# Altium project Relay-Driver-Board-v1.0.PrjPcb (part 5 of 5)
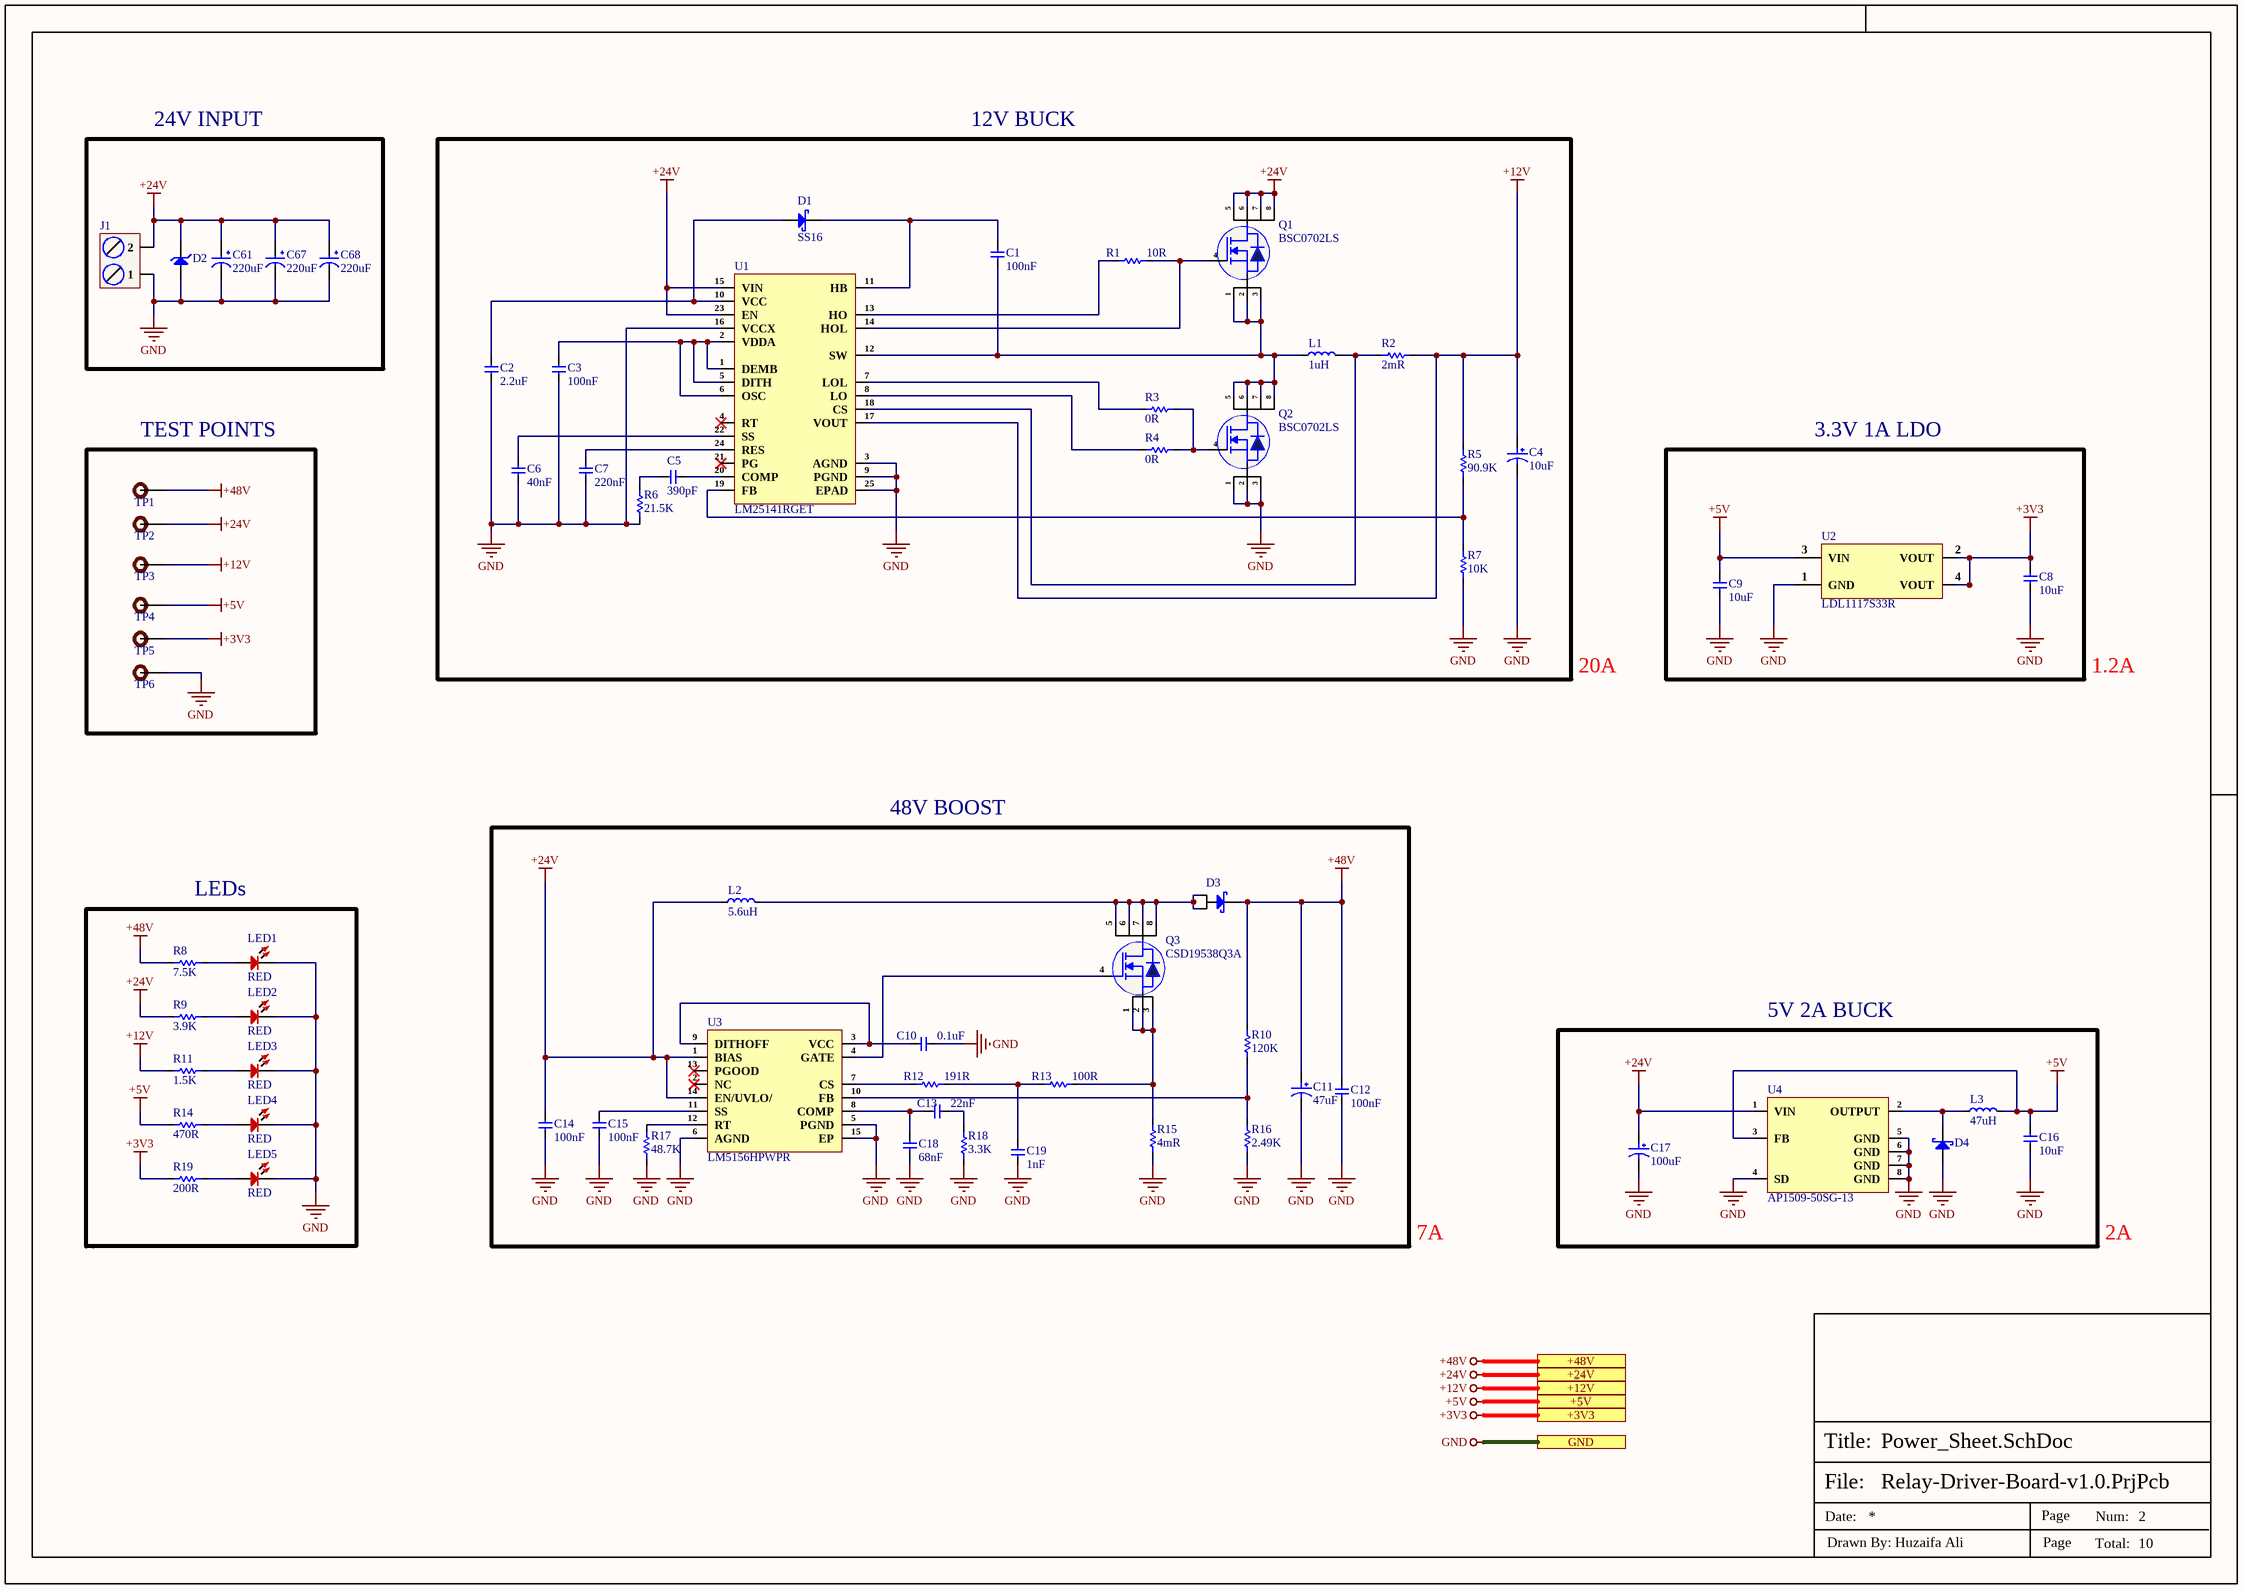
[diagram p11: Power_Sheet.SchDoc]

## Sheet Power_Sheet.SchDoc (continued)

### Library data of the parts (continued)
R19 = RC0402FR-07200RL: RES 200 OHM 1% 1/16W 0402; Manufacturer: Yageo; Temperature Coefficient: 100ppm/°C; Power Rating: 63mW; Voltage Rating (DC): 50V; Supplier 1: Digi-Key; Manufacturer Part Number: RC0402FR-07200RL; RoHS: Yes; Category: Chip SMD Resistors; Stock 1: 19778; Pricing 1: 1=0.10000, 10=0.01600, 100=0.00660, 1000=0.00299, 2500=0.00259, 5000=0.00214 (USD); Case/Package: 0402; Case Code (Metric): 1005; Case Code (Imperial): 0402; Size Code: 0402; Min Operating Temperature: -55°C; Max Operating Temperature: 155°C; Tolerance: 1%; Resistance: 200R; Resistor Type: Thick Film; Packaging: Tape and Reel; Voltage Rating: 50V; Package Quantity: 1; Number of Terminations: 2; Termination: SMD/SMT; Max Power Dissipation: 63mW; Features: Moisture Resistant; Series: RC; Construction: Rectangular; Resistance Tolerance: 1%; Length: 1mm; Width: 0.02inch; Height: 0.016inch; Depth: 0.5mm; REACH SVHC: No SVHC; Lead Free: Lead Free; RoHS Compliant: Yes; Military Standard: Not; ComponentLink1URL: https://datasheet.ciiva.com/2553/pyu-r-int-thick-7-2553232.pdf?src-supplier=Digi-Key; ComponentLink1Description: https://datasheet.ciiva.com/2553/pyu-r-int-thick-7-2553232.pdf?src-supplier=Digi-Key; ComponentLink2URL: https://datasheet.ciiva.com/7983/1018594-7983509.pdf?src-supplier=Element14; ComponentLink2Description: https://datasheet.ciiva.com/7983/1018594-7983509.pdf?src-supplier=Element14; ComponentLink3URL: https://datasheet.ciiva.com/16804/pyu-rc0402-51-rohs-l-6-r-16804406.pdf?src-supplier=Future+Electronics; ComponentLink3Description: https://datasheet.ciiva.com/16804/pyu-rc0402-51-rohs-l-6-r-16804406.pdf?src-supplier=Future+Electronics; ComponentLink4URL: https://datasheet.ciiva.com/15189/getdatasheetpartid-331152-15189383.pdf?src-supplier=Verical; ComponentLink4Description: https://datasheet.ciiva.com/15189/getdatasheetpartid-331152-15189383.pdf?src-supplier=Verical; ComponentLink5URL: https://datasheet.ciiva.com/7849/1018594-7849898.pdf?src-supplier=Element14; ComponentLink5Description: https://datasheet.ciiva.com/7849/1018594-7849898.pdf?src-supplier=Element14; ComponentLink6URL: https://datasheet.ciiva.com/5562/pyu-rc0402-51-rohs-l-6-r-8721-5562539.pdf?src-supplier=Mouser; ComponentLink6Description: https://datasheet.ciiva.com/5562/pyu-rc0402-51-rohs-l-6-r-8721-5562539.pdf?src-supplier=Mouser; ComponentLink7URL: https://datasheet.ciiva.com/7849/1018594-7849899.pdf?src-supplier=Element14; ComponentLink7Description: https://datasheet.ciiva.com/7849/1018594-7849899.pdf?src-supplier=Element14; ComponentLink8URL: https://datasheet.ciiva.com/2553/pyu-r-int-thick-7-2553230.pdf?src-supplier=Digi-Key; ComponentLink8Description: https://datasheet.ciiva.com/2553/pyu-r-int-thick-7-2553230.pdf?src-supplier=Digi-Key; ComponentLink9URL: https://datasheet.ciiva.com/2553/pyu-r-int-thick-7-2553231.pdf?src-supplier=Digi-Key; ComponentLink9Description: https://datasheet.ciiva.com/2553/pyu-r-int-thick-7-2553231.pdf?src-supplier=Digi-Key; Supplier Part Number 1: 311-200LRCT-ND; LCSC Part Number: C114764
TP1-TP6 = TEST POINT: Test Point ON; Item Type: TEST POINT
U1 = LM25141RGET: LOW VOLTAGE LM5141- SYNC BUCK CO; Manufacturer: Texas Instruments; Item Type: IC; Supplier: Digikey; LCSC Part Number: C2658130; Manufacturer Part Number: LM25141RGET; RoHS: Yes; Stock: 976; Pricing: 1=6.33, 10=5.685, 25=5.3744, 100=4.6579 (USD); ComponentLink1URL: http://www.ti.com/lit/ds/symlink/lm25141.pdf?src-supplier=Farnell; ComponentLink1Description: http://www.ti.com/lit/ds/symlink/lm25141.pdf?src-supplier=Farnell; ComponentLink2URL: http://www.ti.com/general/docs/suppproductinfo.tsp?distId=10&gotoUrl=http%3A%2F%2Fwww.ti.com%2Flit%2Fgpn%2Flm25141&src-supplier=Digikey; ComponentLink2Description: http://www.ti.com/general/docs/suppproductinfo.tsp?distId=10&gotoUrl=http%3A%2F%2Fwww.ti.com%2Flit%2Fgpn%2Flm25141&src-supplier=Digikey
U2 = LDL1117S33R: IC REG LINEAR 3.3V 1.2A SOT223; Manufacturer: STMicroelectronics; Output Type: Fixed; Output Configuration: Positive; Number of Regulators: 1; Max Input Voltage: 18V; Dropout Voltage: 600mV; Quiescent Current: 500uA; Power Supply Rejection Ratio (PSRR): 65dB; Supplier 1: Digi-Key; Manufacturer Part Number: LDL1117S33R; Stock 1: 13064; Pricing 1: 1=0.45, 10=0.362, 100=0.2465, 500=0.1849, 1000=0.13867 (USD); Mount: Surface Mount; Case/Package: TO-261-4; Min Operating Temperature: -40°C; Max Operating Temperature: 125°C; Packaging: Tape and Reel; Min Output Voltage: 3.3V; Output Current: 1.2A; Supplier Part Number 1: 497-17239-6-ND; ComponentLink1Description: LCSC; ComponentLink1URL: https://www.lcsc.com/product-detail/Linear-Voltage-Regulators-LDO_STMicroelectronics-LDL1117S33R_C435835.html; LCSC Part Number: C435835; Item Type: IC
U3 = LM5156HPWPR: 2.2MHZ WIDE INPUT NONSYNCHRONOUS; Manufacturer: Texas Instruments; Item Type: IC; Supplier: Digikey; LCSC Part Number: C2867852; Manufacturer Part Number: LM5156HPWPR; RoHS: No; Stock: 2799; Pricing: 1=2.18, 10=1.954, 25=1.8432, 100=1.5704, 250=1.4746, 500=1.29028, 1000=1.06908 (USD)
U4 = AP1509-50SG-13: IC REG BUCK 5V 2A 8SOP; Manufacturer: Diodes; Number of Outputs: 1; Min Input Voltage: 4.5V; Max Supply Voltage: 22V; Efficiency: 83%; Switching Frequency: 150kHz; Synchronous Rectifier: No; Operating Supply Current: 5mA; Output Type: Fixed; Output Configuration: Positive; Frequency: 173kHz; Supplier 1: Rs; Manufacturer Part Number: AP1509-50SG-13; RoHS: Yes; Category: Voltage Regulators - Switching; Stock 1: 2230; Pricing 1: 25=1.20600, 125=0.91800, 625=0.81800, 1250=0.63800 (GBP); Mounting Technology: Surface Mount; Case/Package: SOP; Pins: 8; Weight: 0.030018oz; Contact Plating: Tin,Matte; Min Operating Temperature: -20°C; Max Operating Temperature: 85°C; Packaging: Tape and Reel; Output Voltage: 5V; Max Output current: 2A; Package Quantity: 2500; Output Current: 2A; Min Supply Voltage: 4.5V; Nominal Output Voltage: 5V; Min Output Voltage: 5V; Max Output Voltage: 5V; Operating Supply Voltage: 22V; Series: -; Length: 4.95mm; Width: 3.95mm; Height: 1.5mm; Reach SVHC Compliant: Yes; Lead Free: Lead Free; RoHS Compliant: Yes; ComponentLink1URL: https://datasheet.ciiva.com/1161/608784-1161660.pdf?src-supplier=Element14; ComponentLink1Description: https://datasheet.ciiva.com/1161/608784-1161660.pdf?src-supplier=Element14; Supplier Part Number 1: 7512923P; LCSC Part Number: C9984; Item Type: IC

## Sheet Relay_PWR_Sheet.SchDoc
size 420 x 297 mm; SheetNumber: 8; SheetTotal: 9
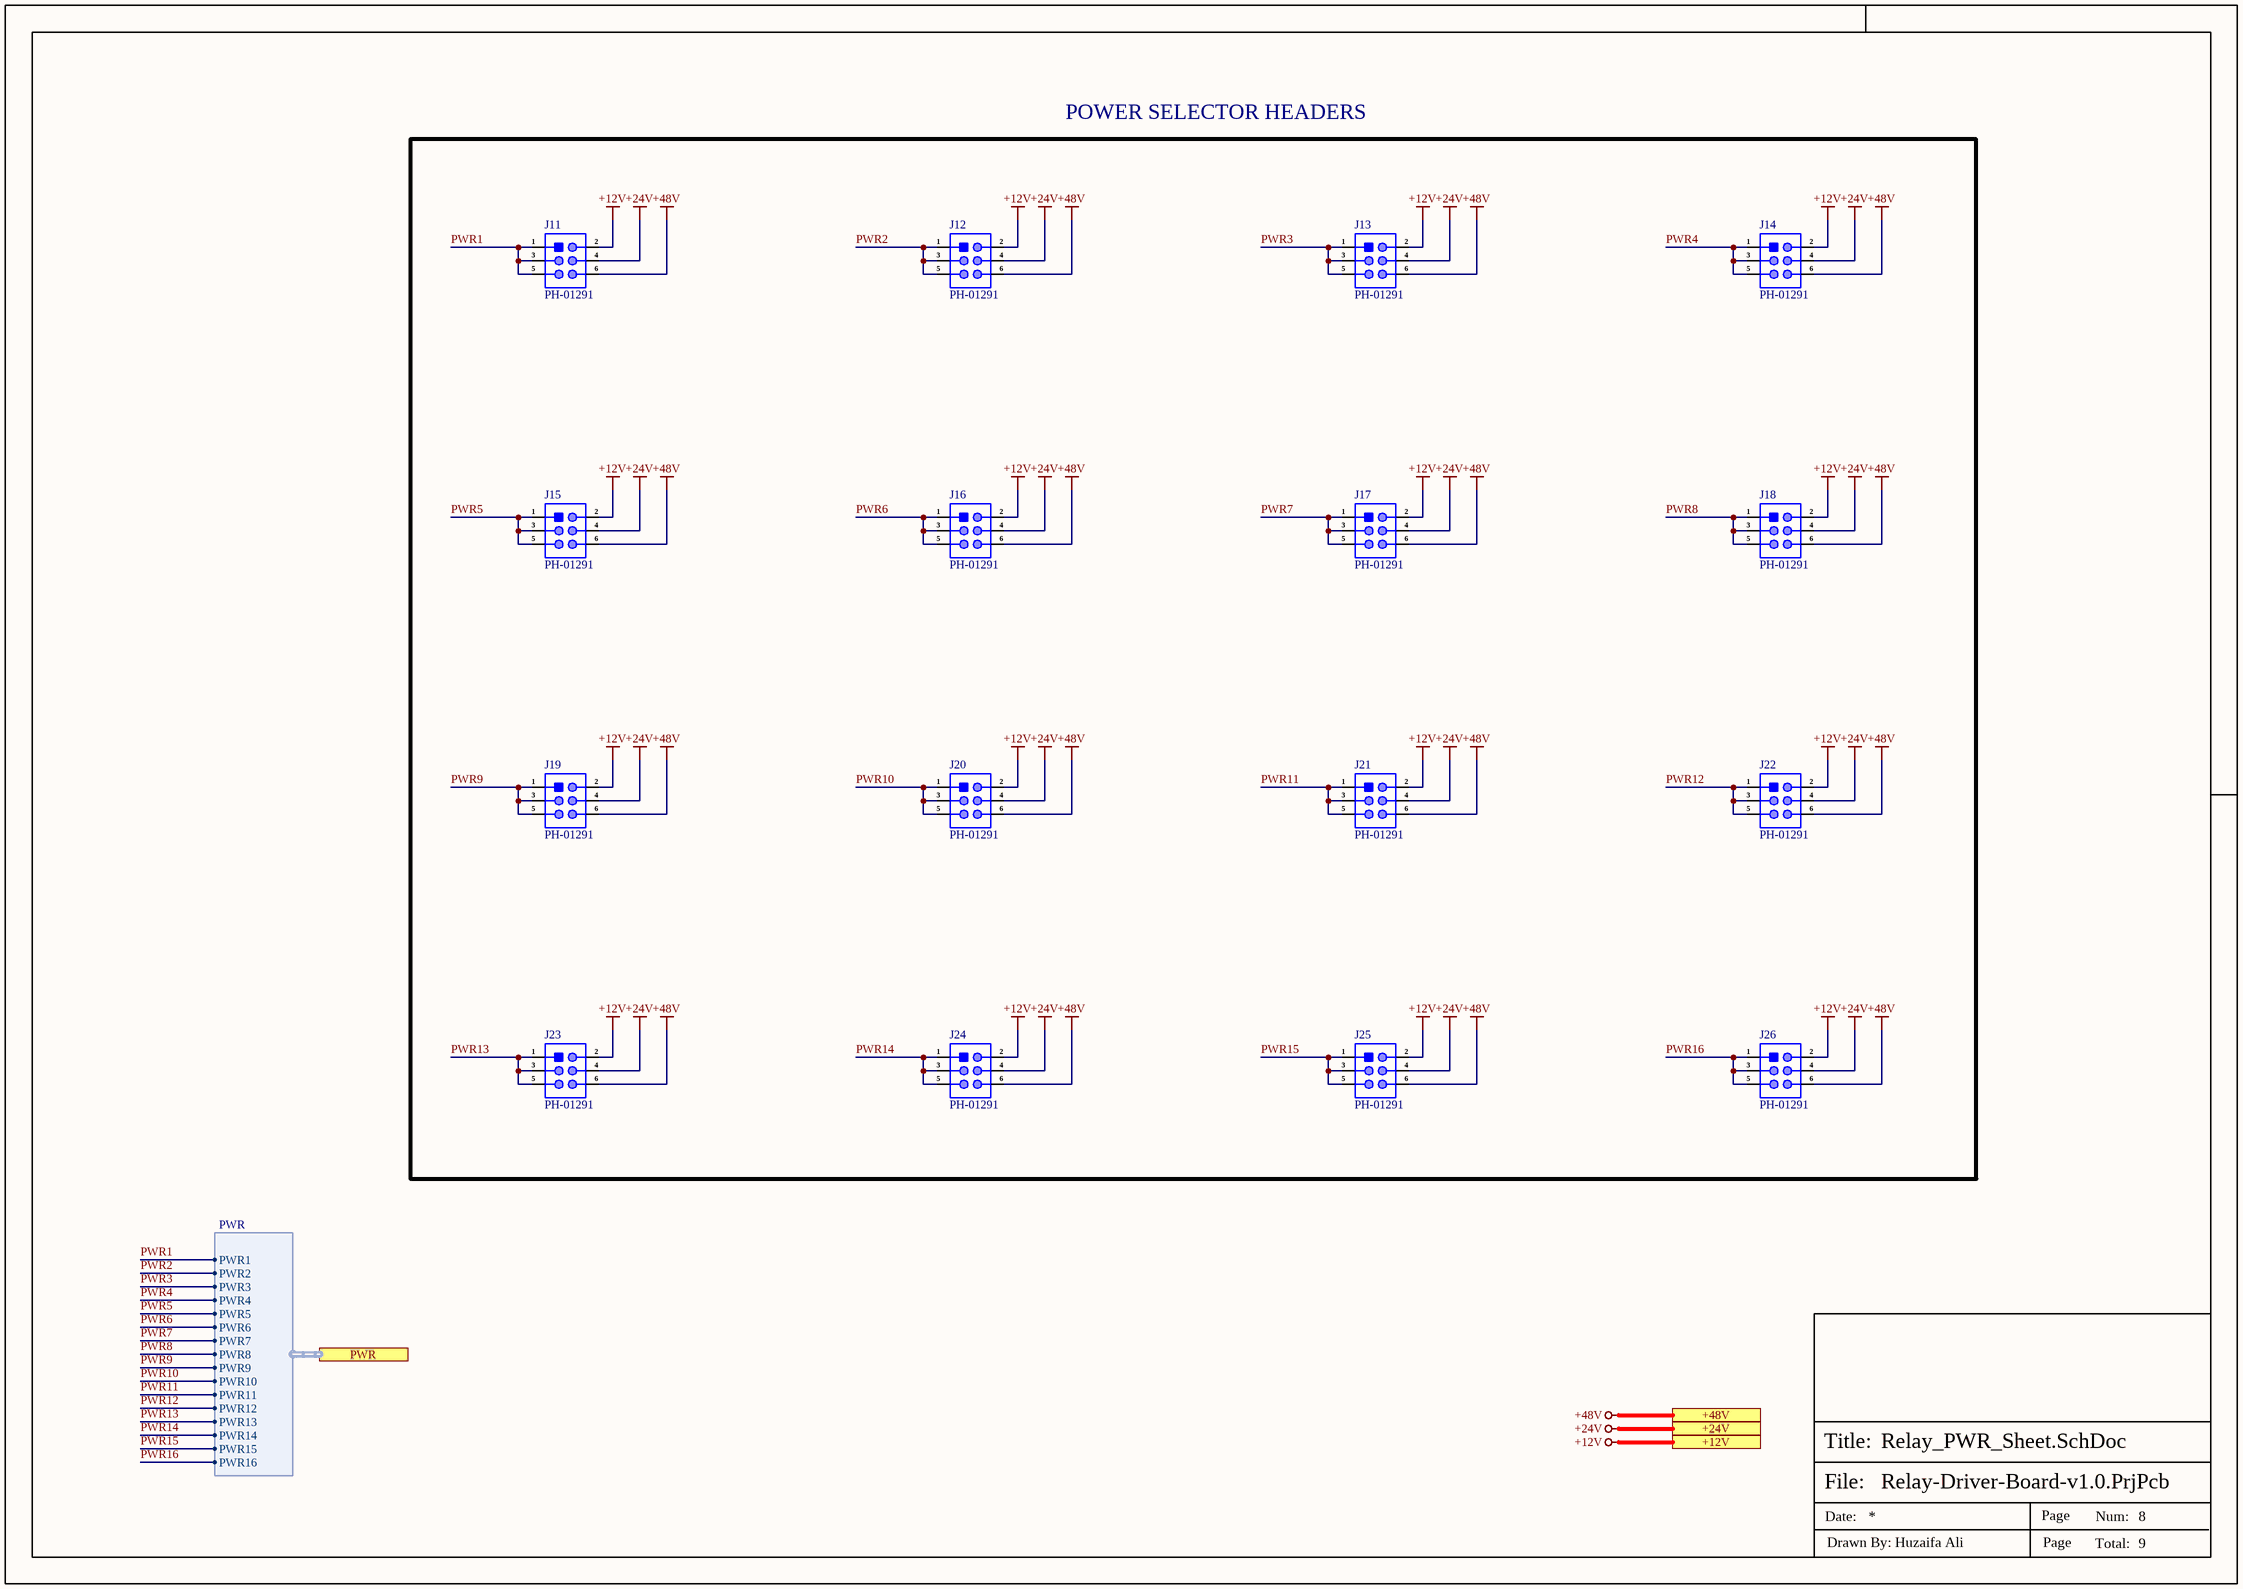
[diagram p6: Relay_PWR_Sheet.SchDoc]

### Parts
J11  PH-01291  [PH-01291]
J12  PH-01291  [PH-01291]
J13  PH-01291  [PH-01291]
J14  PH-01291  [PH-01291]
J15  PH-01291  [PH-01291]
J16  PH-01291  [PH-01291]
J17  PH-01291  [PH-01291]
J18  PH-01291  [PH-01291]
J19  PH-01291  [PH-01291]
J20  PH-01291  [PH-01291]
J21  PH-01291  [PH-01291]
J22  PH-01291  [PH-01291]
J23  PH-01291  [PH-01291]
J24  PH-01291  [PH-01291]
J25  PH-01291  [PH-01291]
J26  PH-01291  [PH-01291]

### Blocks framed on the sheet
POWER SELECTOR HEADERS: J11-J26

### Ports
+12V (see Power_Sheet[5D]), +24V (see Connector_Sheet[5D], Power_Sheet[5D]), +48V (see Power_Sheet[5D]), PWR (harness PWR, see Relay_Sheet[4D])

### Harnesses
PWR: PWR1, PWR2, PWR3, PWR4, PWR5, PWR6, PWR7, PWR8, PWR9, PWR10, PWR11, PWR12, PWR13, PWR14, PWR15, PWR16

### Nets
+12V: J11.2 J12.2 J13.2 J14.2 J15.2 J16.2 J17.2 J18.2 J19.2 J20.2 J21.2 J22.2 J23.2 J24.2 J25.2 J26.2 ; port +12V
+24V: J11.4 J12.4 J13.4 J14.4 J15.4 J16.4 J17.4 J18.4 J19.4 J20.4 J21.4 J22.4 J23.4 J24.4 J25.4 J26.4 ; port +24V
+48V: J11.6 J12.6 J13.6 J14.6 J15.6 J16.6 J17.6 J18.6 J19.6 J20.6 J21.6 J22.6 J23.6 J24.6 J25.6 J26.6 ; port +48V
PWR1: J11.1 J11.3 J11.5 ; port PWR.PWR1
PWR2: J12.1 J12.3 J12.5 ; port PWR.PWR2
PWR3: J13.1 J13.3 J13.5 ; port PWR.PWR3
PWR4: J14.1 J14.3 J14.5 ; port PWR.PWR4
PWR5: J15.1 J15.3 J15.5 ; port PWR.PWR5
PWR6: J16.1 J16.3 J16.5 ; port PWR.PWR6
PWR7: J17.1 J17.3 J17.5 ; port PWR.PWR7
PWR8: J18.1 J18.3 J18.5 ; port PWR.PWR8
PWR9: J19.1 J19.3 J19.5 ; port PWR.PWR9
PWR10: J20.1 J20.3 J20.5 ; port PWR.PWR10
PWR11: J21.1 J21.3 J21.5 ; port PWR.PWR11
PWR12: J22.1 J22.3 J22.5 ; port PWR.PWR12
PWR13: J23.1 J23.3 J23.5 ; port PWR.PWR13
PWR14: J24.1 J24.3 J24.5 ; port PWR.PWR14
PWR15: J25.1 J25.3 J25.5 ; port PWR.PWR15
PWR16: J26.1 J26.3 J26.5 ; port PWR.PWR16

### Notes on the sheet
- File:
- Title:
- Date:
- Page
- Num:
- Total:
- Drawn By: Huzaifa Ali

### Library data of the parts
J11-J26 = PH-01291: 3A Straight Square Pins 2.5mm 6P 6mm -40℃~+105℃ 3mm 2.54mm 双排 Black 2x3P 2.54mm Plugin,P=2.54mm Pin Headers ROHS; Manufacturer: Liansheng; Item Type: Male Header; Manufacturer Part Number: PH-01291; LCSC Part No: C2685197; ComponentLink1URL: https://www.lcsc.com/product-detail/Pin-Headers_Liansheng-PH-01291_C2685197.html; ComponentLink1Description: LCSC

## Sheet Relay_Sheet.SchDoc
size 420 x 297 mm; SheetNumber: 8; SheetTotal: 10
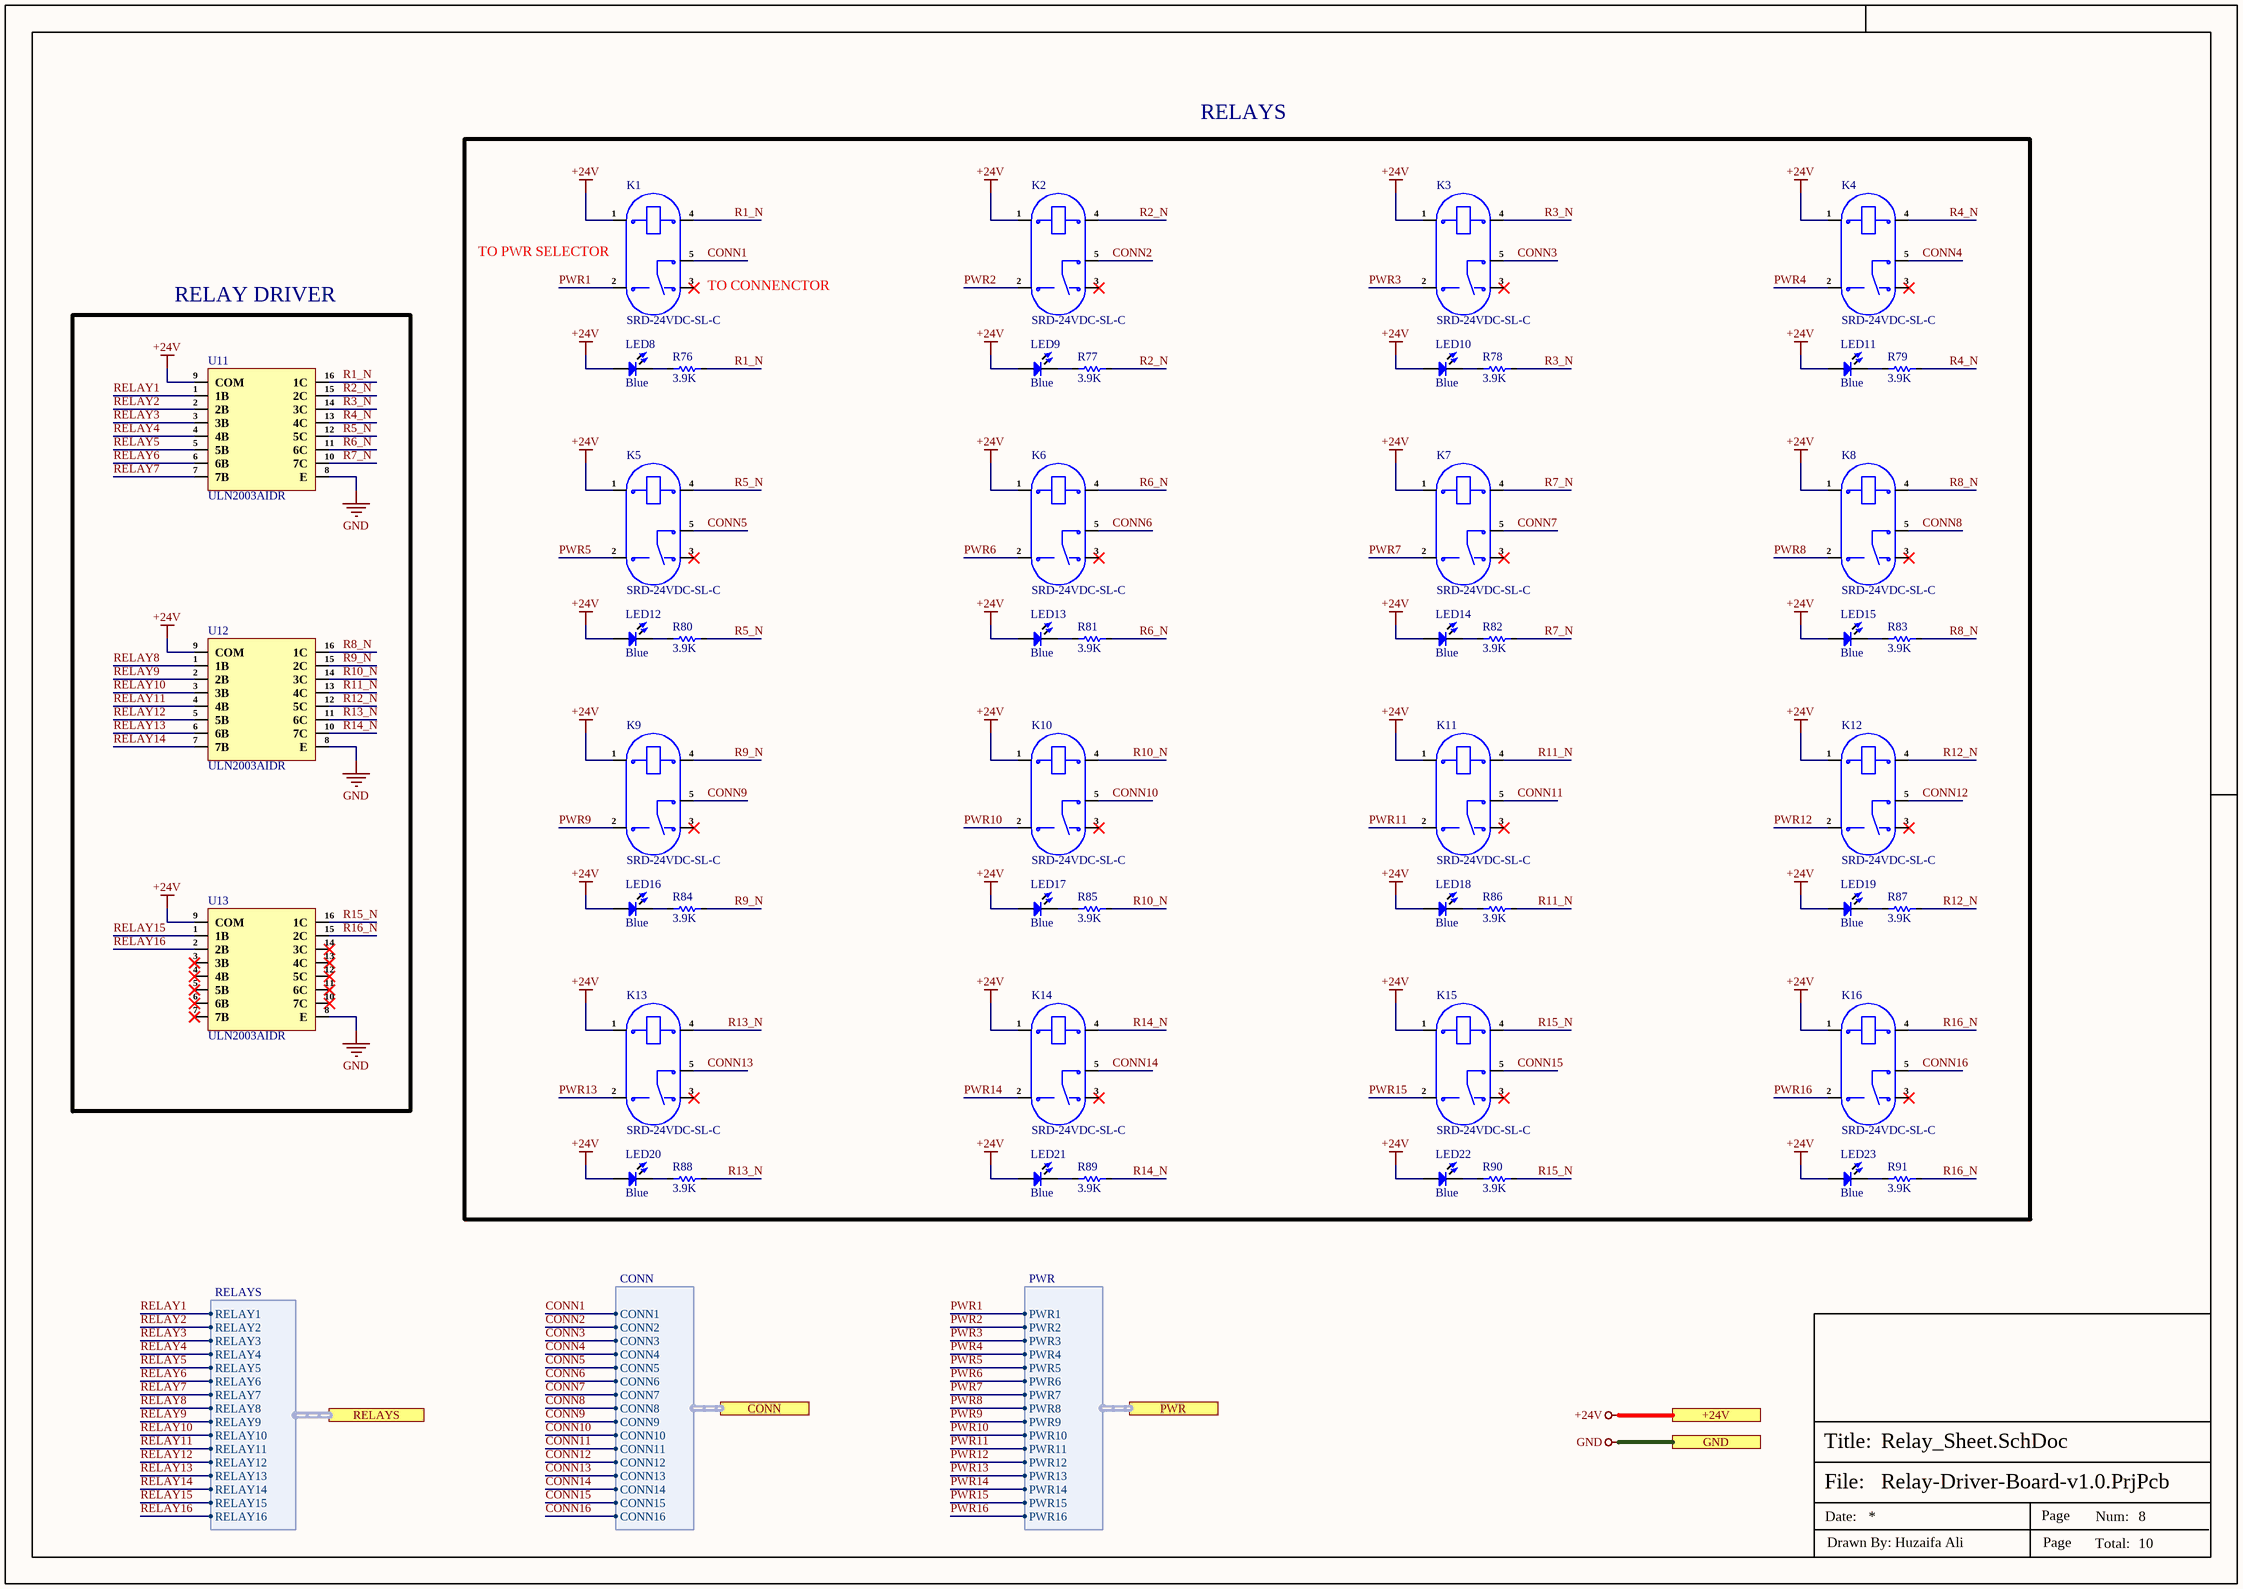
[diagram p7: Relay_Sheet.SchDoc]

### Parts
K1  SRD-24VDC-SL-C  [SRD-24VDC-SL-C]
K2  SRD-24VDC-SL-C  [SRD-24VDC-SL-C]
K3  SRD-24VDC-SL-C  [SRD-24VDC-SL-C]
K4  SRD-24VDC-SL-C  [SRD-24VDC-SL-C]
K5  SRD-24VDC-SL-C  [SRD-24VDC-SL-C]
K6  SRD-24VDC-SL-C  [SRD-24VDC-SL-C]
K7  SRD-24VDC-SL-C  [SRD-24VDC-SL-C]
K8  SRD-24VDC-SL-C  [SRD-24VDC-SL-C]
K9  SRD-24VDC-SL-C  [SRD-24VDC-SL-C]
K10  SRD-24VDC-SL-C  [SRD-24VDC-SL-C]
K11  SRD-24VDC-SL-C  [SRD-24VDC-SL-C]
K12  SRD-24VDC-SL-C  [SRD-24VDC-SL-C]
K13  SRD-24VDC-SL-C  [SRD-24VDC-SL-C]
K14  SRD-24VDC-SL-C  [SRD-24VDC-SL-C]
K15  SRD-24VDC-SL-C  [SRD-24VDC-SL-C]
K16  SRD-24VDC-SL-C  [SRD-24VDC-SL-C]
LED8  Blue  [LED-0603]
LED9  Blue  [LED-0603]
LED10  Blue  [LED-0603]
LED11  Blue  [LED-0603]
LED12  Blue  [LED-0603]
LED13  Blue  [LED-0603]
LED14  Blue  [LED-0603]
LED15  Blue  [LED-0603]
LED16  Blue  [LED-0603]
LED17  Blue  [LED-0603]
LED18  Blue  [LED-0603]
LED19  Blue  [LED-0603]
LED20  Blue  [LED-0603]
LED21  Blue  [LED-0603]
LED22  Blue  [LED-0603]
LED23  Blue  [LED-0603]
R76  3.9K  [Res-0402]
R77  3.9K  [Res-0402]
R78  3.9K  [Res-0402]
R79  3.9K  [Res-0402]
R80  3.9K  [Res-0402]
R81  3.9K  [Res-0402]
R82  3.9K  [Res-0402]
R83  3.9K  [Res-0402]
R84  3.9K  [Res-0402]
R85  3.9K  [Res-0402]
R86  3.9K  [Res-0402]
R87  3.9K  [Res-0402]
R88  3.9K  [Res-0402]
R89  3.9K  [Res-0402]
R90  3.9K  [Res-0402]
R91  3.9K  [Res-0402]
U11  ULN2003AIDR  [16-SOIC (0.154", 3.90mm Width)]
U12  ULN2003AIDR  [16-SOIC (0.154", 3.90mm Width)]
U13  ULN2003AIDR  [16-SOIC (0.154", 3.90mm Width)]

### Blocks framed on the sheet
RELAYS: K1-K16 LED8-LED23 R76-R91
RELAY DRIVER: U11-U13

### Ports
+24V (see Top_Sheet[2B], Connector_Sheet[5D], Power_Sheet[5D], Relay_PWR_Sheet[5D]), CONN (harness CONN, see Top_Sheet[2C], Connector_Sheet[4D]), GND (see Top_Sheet[2C], CAN_Sheet[5D], Connector_Sheet[5D], Controller_Sheet[5D], EtherCAT_Sheet[5D], Power_Sheet[5D], RJ45_Sheet[5D], RS485_RS232_Sheet[5D]), PWR (harness PWR, see Top_Sheet[2C], Relay_PWR_Sheet[1D]), RELAYS (harness RELAYS, see Top_Sheet[3B], Controller_Sheet[4D])

### Harnesses
RELAYS: RELAY1, RELAY2, RELAY3, RELAY4, RELAY5, RELAY6, RELAY7, RELAY8, RELAY9, RELAY10, RELAY11, RELAY12, RELAY13, RELAY14, RELAY15, RELAY16
CONN: CONN1, CONN2, CONN3, CONN4, CONN5, CONN6, CONN7, CONN8, CONN9, CONN10, CONN11, CONN12, CONN13, CONN14, CONN15, CONN16
PWR: PWR1, PWR2, PWR3, PWR4, PWR5, PWR6, PWR7, PWR8, PWR9, PWR10, PWR11, PWR12, PWR13, PWR14, PWR15, PWR16

### Nets
+24V: K1.1 K2.1 K3.1 K4.1 K5.1 K6.1 K7.1 K8.1 K9.1 K10.1 K11.1 K12.1 K13.1 K14.1 K15.1 K16.1 LED8.1 LED9.1 LED10.1 LED11.1 LED12.1 LED13.1 LED14.1 LED15.1 LED16.1 LED17.1 LED18.1 LED19.1 LED20.1 LED21.1 LED22.1 LED23.1 U11.9(COM) U12.9(COM) U13.9(COM) ; port +24V
GND: U11.8(E) U12.8(E) U13.8(E) ; port GND
CONN1: K1.5 ; port CONN.CONN1
CONN2: K2.5 ; port CONN.CONN2
CONN3: K3.5 ; port CONN.CONN3
CONN4: K4.5 ; port CONN.CONN4
CONN5: K5.5 ; port CONN.CONN5
CONN6: K6.5 ; port CONN.CONN6
CONN7: K7.5 ; port CONN.CONN7
CONN8: K8.5 ; port CONN.CONN8
CONN9: K9.5 ; port CONN.CONN9
CONN10: K10.5 ; port CONN.CONN10
CONN11: K11.5 ; port CONN.CONN11
CONN12: K12.5 ; port CONN.CONN12
CONN13: K13.5 ; port CONN.CONN13
CONN14: K14.5 ; port CONN.CONN14
CONN15: K15.5 ; port CONN.CONN15
CONN16: K16.5 ; port CONN.CONN16
PWR1: K1.2 ; port PWR.PWR1
PWR2: K2.2 ; port PWR.PWR2
PWR3: K3.2 ; port PWR.PWR3
PWR4: K4.2 ; port PWR.PWR4
PWR5: K5.2 ; port PWR.PWR5
PWR6: K6.2 ; port PWR.PWR6
PWR7: K7.2 ; port PWR.PWR7
PWR8: K8.2 ; port PWR.PWR8
PWR9: K9.2 ; port PWR.PWR9
PWR10: K10.2 ; port PWR.PWR10
PWR11: K11.2 ; port PWR.PWR11
PWR12: K12.2 ; port PWR.PWR12
PWR13: K13.2 ; port PWR.PWR13
PWR14: K14.2 ; port PWR.PWR14
PWR15: K15.2 ; port PWR.PWR15
PWR16: K16.2 ; port PWR.PWR16
R1_N: K1.4 R76.2 U11.16(1C)
R2_N: K2.4 R77.2 U11.15(2C)
R3_N: K3.4 R78.2 U11.14(3C)
R4_N: K4.4 R79.2 U11.13(4C)
R5_N: K5.4 R80.2 U11.12(5C)
R6_N: K6.4 R81.2 U11.11(6C)
R7_N: K7.4 R82.2 U11.10(7C)
R8_N: K8.4 R83.2 U12.16(1C)
R9_N: K9.4 R84.2 U12.15(2C)
R10_N: K10.4 R85.2 U12.14(3C)
R11_N: K11.4 R86.2 U12.13(4C)
R12_N: K12.4 R87.2 U12.12(5C)
R13_N: K13.4 R88.2 U12.11(6C)
R14_N: K14.4 R89.2 U12.10(7C)
R15_N: K15.4 R90.2 U13.16(1C)
R16_N: K16.4 R91.2 U13.15(2C)
RELAY1: U11.1(1B) ; port RELAYS.RELAY1
RELAY2: U11.2(2B) ; port RELAYS.RELAY2
RELAY3: U11.3(3B) ; port RELAYS.RELAY3
RELAY4: U11.4(4B) ; port RELAYS.RELAY4
RELAY5: U11.5(5B) ; port RELAYS.RELAY5
RELAY6: U11.6(6B) ; port RELAYS.RELAY6
RELAY7: U11.7(7B) ; port RELAYS.RELAY7
RELAY8: U12.1(1B) ; port RELAYS.RELAY8
RELAY9: U12.2(2B) ; port RELAYS.RELAY9
RELAY10: U12.3(3B) ; port RELAYS.RELAY10
RELAY11: U12.4(4B) ; port RELAYS.RELAY11
RELAY12: U12.5(5B) ; port RELAYS.RELAY12
RELAY13: U12.6(6B) ; port RELAYS.RELAY13
RELAY14: U12.7(7B) ; port RELAYS.RELAY14
RELAY15: U13.1(1B) ; port RELAYS.RELAY15
RELAY16: U13.2(2B) ; port RELAYS.RELAY16
NetLED8_2: LED8.2 R76.1
NetLED9_2: LED9.2 R77.1
NetLED10_2: LED10.2 R78.1
NetLED11_2: LED11.2 R79.1
NetLED12_2: LED12.2 R80.1
NetLED13_2: LED13.2 R81.1
NetLED14_2: LED14.2 R82.1
NetLED15_2: LED15.2 R83.1
NetLED16_2: LED16.2 R84.1
NetLED17_2: LED17.2 R85.1
NetLED18_2: LED18.2 R86.1
NetLED19_2: LED19.2 R87.1
NetLED20_2: LED20.2 R88.1
NetLED21_2: LED21.2 R89.1
NetLED22_2: LED22.2 R90.1
NetLED23_2: LED23.2 R91.1

Not connected (* = marked no-connect by the designer): K1 3*; K2 3*; K3 3*; K4 3*; K5 3*; K6 3*; K7 3*; K8 3*; K9 3*; K10 3*; K11 3*; K12 3*; K13 3*; K14 3*; K15 3*; K16 3*; U13 3(3B)* 4(4B)* 5(5B)* 6(6B)* 7(7B)* 10(7C)* 11(6C)* 12(5C)* 13(4C)* 14(3C)*

### Notes on the sheet
- (near K1) TO PWR SELECTOR
- (near K1) TO CONNENCTOR
- File:
- Title:
- Date:
- Page
- Num:
- Total:
- Drawn By: Huzaifa Ali

### Library data of the parts
K1-K16 = SRD-24VDC-SL-C: 250V@AC 24V 15A SPDT (1 Form C) Plugin,15.6x19.2mm Power Relays ROHS; Manufacturer: Ningbo Forward Relay; Item Type: Relay; Supplier: LCSC; LCSC Part Number: C15840; Manufacturer Part Number: SRD-24VDC-SL-C; RoHS: No
LED8-LED23 = NCD0603B3: blue 0603 Light Emitting Diodes (LED) ROHS; Manufacturer: Foshan NationStar Optoelectronics; Manufacturer Part Number: NCD0603B3; Package: 0603; LCSC Part Number: C158101; Item Type: LED; ComponentLink1Description: LCSC; ComponentLink1URL: https://www.lcsc.com/product-detail/Light-Emitting-Diodes-LED_Foshan-NationStar-Optoelectronics-NCD0603B3_C158101.html
R76-R91 = RC0402FR-073K9L: RES 3.9K OHM 1% 1/16W 0402; Manufacturer: Yageo; Temperature Coefficient: 100ppm/°C; Power Rating: 62.5mW; Value: 3.9kR; Voltage Rating: 50V; Max Power Dissipation: 63mW; Item Type: Resistor; Supplier: Future Electronics; Supplier Part Number: 9808155; Manufacturer Part Number: RC0402FR-073K9L; RoHS: Yes; Category: Chip SMD Resistors; Stock: 6910000; Pricing: 10000=0.0011, 100000=0.0011, 300000=0.001, 750000=0.001, 2000000=0.0009 (USD); Case/Package: 0402; Case Code (Imperial): 0402; Case Code (Metric): 1005; Min Operating Temperature: -55°C; Max Operating Temperature: 155°C; Tolerance: 1%; Packaging: Tape and Reel; Resistor Type: Thick Film; Series: RC; Termination: SMD/SMT; Number of Terminations: 2; Features: Moisture Resistant; Resistance Tolerance: 1%; Construction: Rectangular; Voltage Rating (AC): 50V; Length: 1mm; Depth: 0.5mm; Lead Free: Lead Free; RoHS Compliant: Yes; Reach SVHC Compliant: Unknown; Military Standard: Not; ComponentLink1URL: https://datasheet.ciiva.com/12666/pyu-rc0402-51-rohs-l-6-r-12666997.pdf?src-supplier=Mouser; ComponentLink1Description: https://datasheet.ciiva.com/12666/pyu-rc0402-51-rohs-l-6-r-12666997.pdf?src-supplier=Mouser; ComponentLink2URL: https://datasheet.ciiva.com/7849/1018594-7849989.pdf?src-supplier=Element14; ComponentLink2Description: https://datasheet.ciiva.com/7849/1018594-7849989.pdf?src-supplier=Element14; ComponentLink3URL: https://datasheet.ciiva.com/7849/1018594-7849990.pdf?src-supplier=Element14; ComponentLink3Description: https://datasheet.ciiva.com/7849/1018594-7849990.pdf?src-supplier=Element14; ComponentLink4URL: https://datasheet.ciiva.com/15189/getdatasheetpartid-469246-15189453.pdf?src-supplier=Verical; ComponentLink4Description: https://datasheet.ciiva.com/15189/getdatasheetpartid-469246-15189453.pdf?src-supplier=Verical; LCSC Part Number: C131467
U11-U13 = ULN2003AIDR: IC PWR RELAY 7NPN 1:1 16SOIC; Manufacturer: Texas Instruments; Supplier: Mouser; Supplier Part Number: 595-ULN2003AIDR; Manufacturer Part Number: ULN2003AIDR; RoHS: Yes; Item Type: IC; Stock: 2012; Pricing: 1=0.66, 10=0.589, 50=0.589, 100=0.402, 1000=0.285, 10000=0.232 (USD); ComponentLink1URL: https://datasheet.ciiva.com/15139/getdatasheetpartid-47948-15139878.pdf?src-supplier=Verical; ComponentLink1Description: https://datasheet.ciiva.com/15139/getdatasheetpartid-47948-15139878.pdf?src-supplier=Verical; ComponentLink2URL: https://datasheet.ciiva.com/14424/ulq2003a-14424030.pdf?src-supplier=Avnet; ComponentLink2Description: https://datasheet.ciiva.com/14424/ulq2003a-14424030.pdf?src-supplier=Avnet; ComponentLink3URL: https://datasheet.ciiva.com/1700/uln2003ai-1700820.pdf?src-supplier=Digikey; ComponentLink3Description: https://datasheet.ciiva.com/1700/uln2003ai-1700820.pdf?src-supplier=Digikey; ComponentLink4URL: https://datasheet.ciiva.com/1700/uln2003ai-1700821.pdf?src-supplier=Digikey; ComponentLink4Description: https://datasheet.ciiva.com/1700/uln2003ai-1700821.pdf?src-supplier=Digikey; ComponentLink5URL: https://datasheet.ciiva.com/1700/uln2003ai-1700822.pdf?src-supplier=Digikey; ComponentLink5Description: https://datasheet.ciiva.com/1700/uln2003ai-1700822.pdf?src-supplier=Digikey

## Sheet RS485_RS232_Sheet.SchDoc
size 420 x 297 mm; SheetNumber: 5; SheetTotal: 10
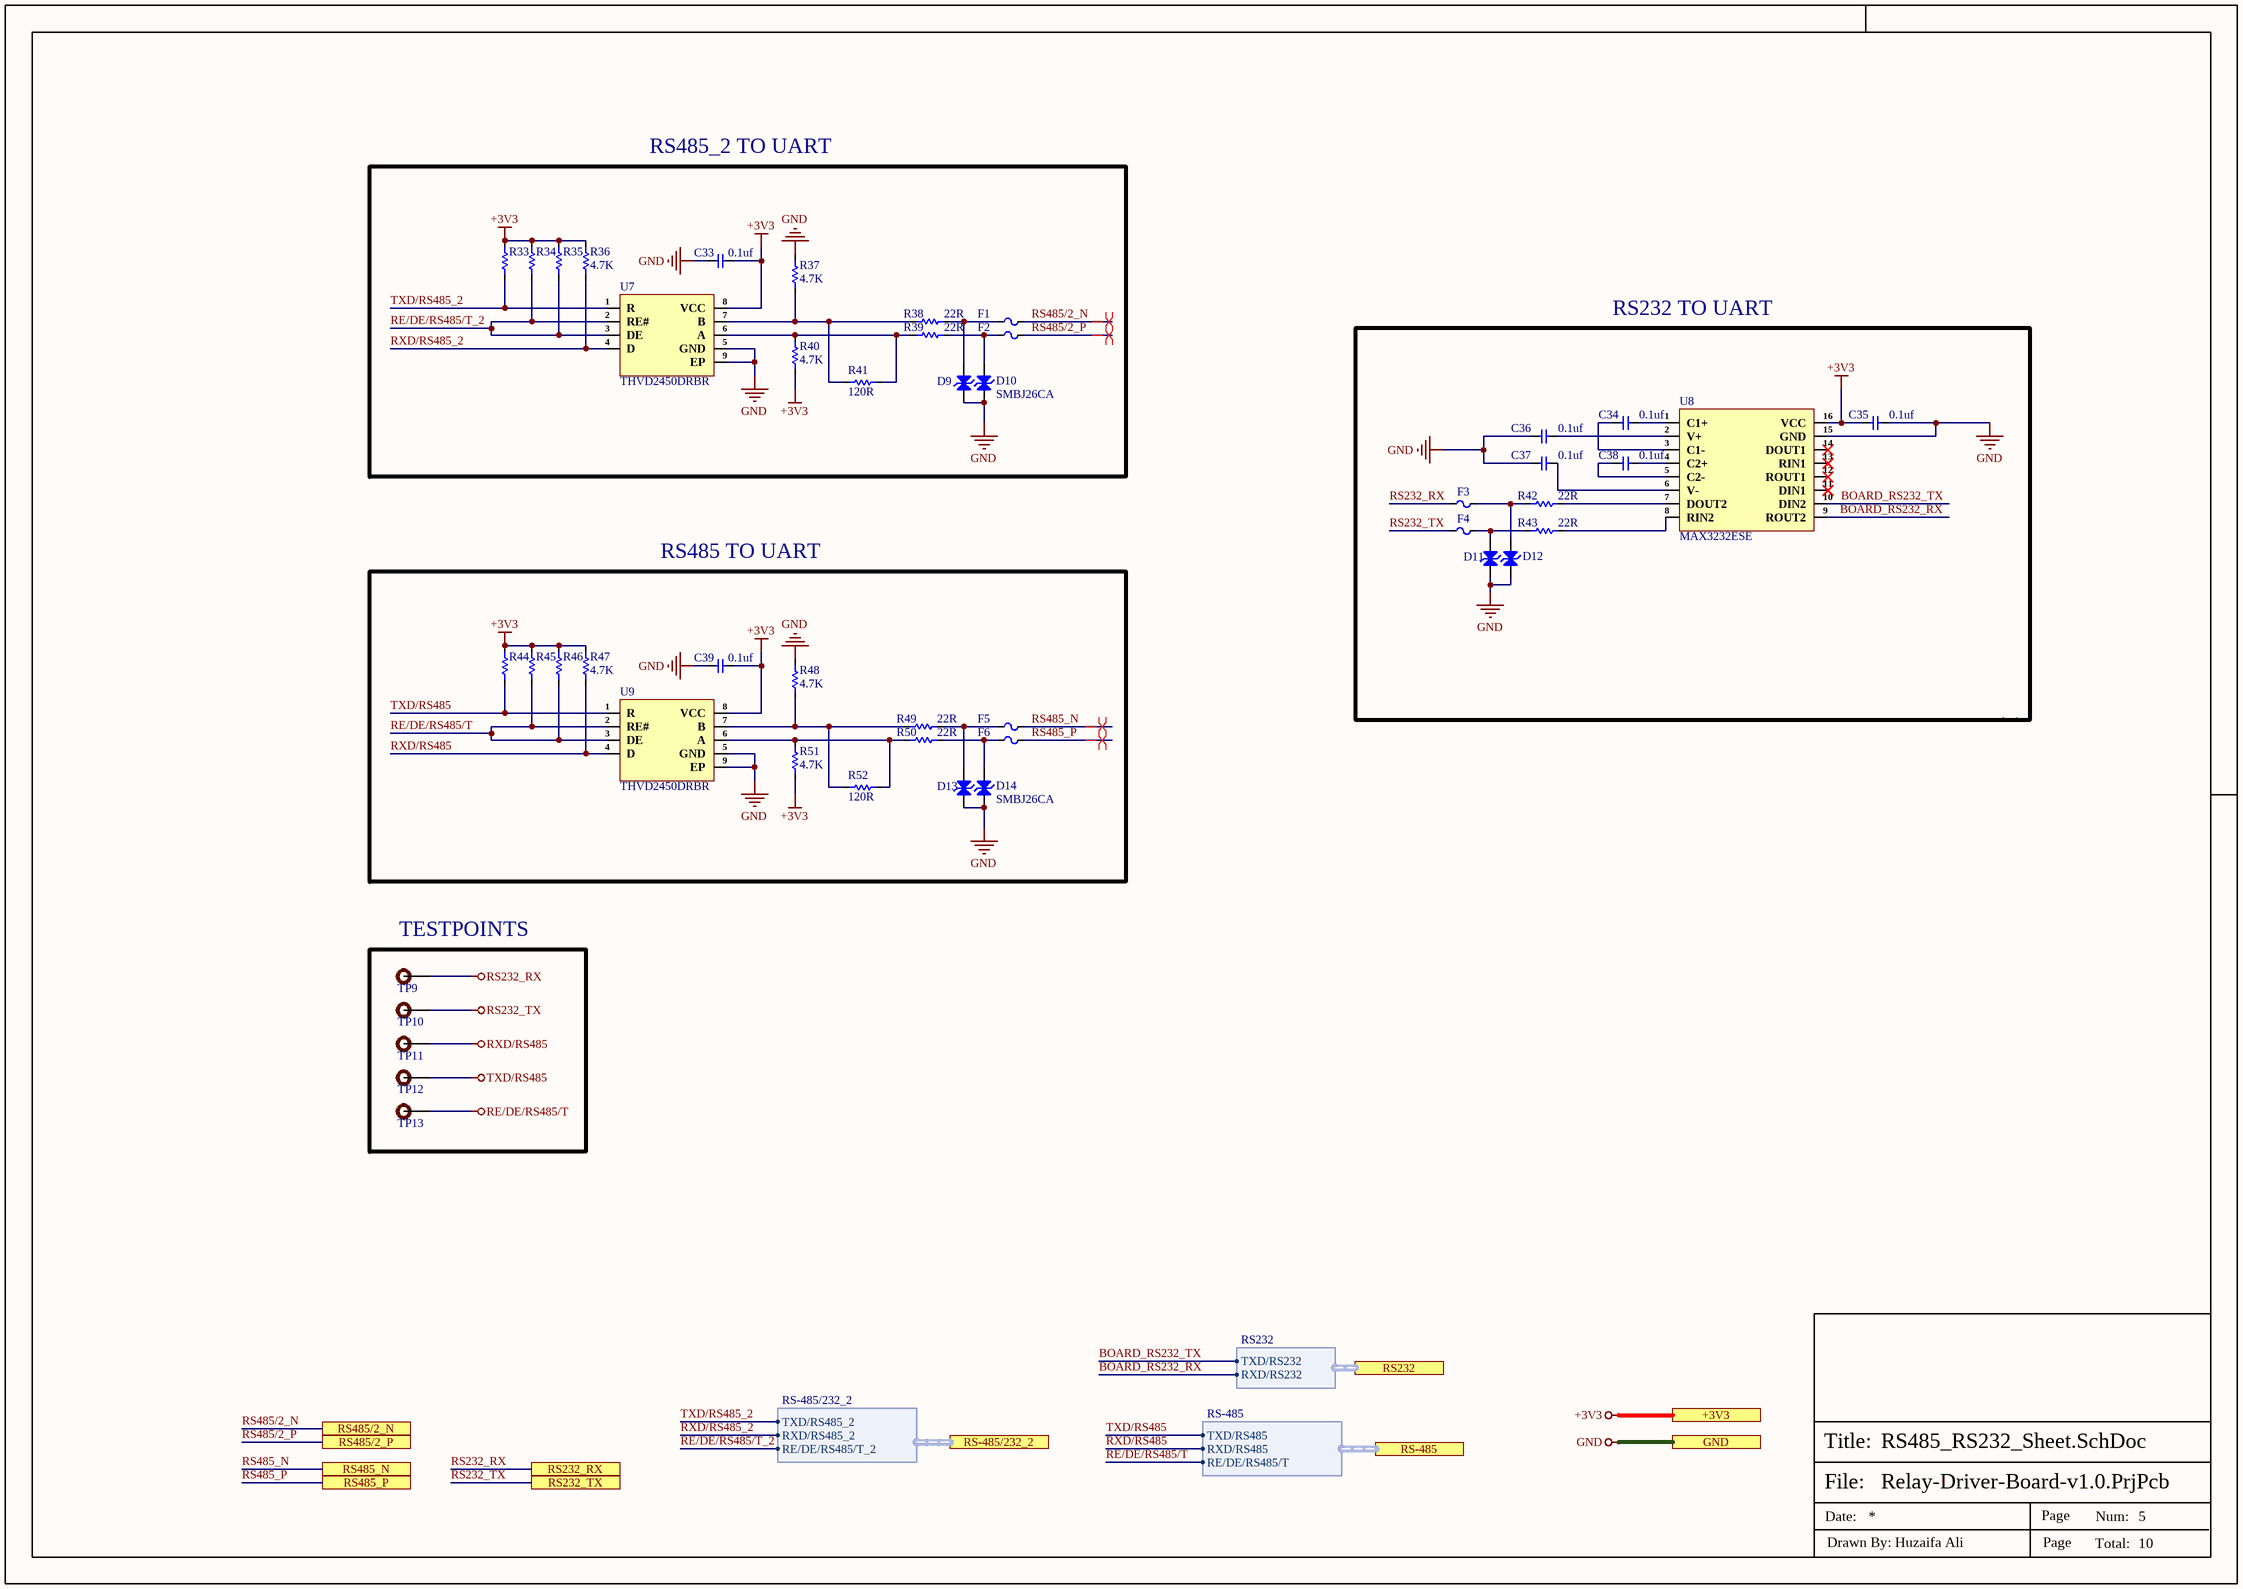
[diagram p8: RS485_RS232_Sheet.SchDoc]

### Parts
C33  0.1uf  [Cap-0402]
C34  0.1uf  [Cap-0402]
C35  0.1uf  [Cap-0402]
C36  0.1uf  [Cap-0402]
C37  0.1uf  [Cap-0402]
C38  0.1uf  [Cap-0402]
C39  0.1uf  [Cap-0402]
D9  SMBJ26CA  [SMB Bi Directional]  (value not drawn)
D10  SMBJ26CA  [SMB Bi Directional]
D11  SMBJ26CA  [SMB Bi Directional]  (value not drawn)
D12  SMBJ26CA  [SMB Bi Directional]  (value not drawn)
D13  SMBJ26CA  [SMB Bi Directional]  (value not drawn)
D14  SMBJ26CA  [SMB Bi Directional]
F1  SMD0805P020TF  [Fuse-0805]  (value not drawn)
F2  SMD0805P020TF  [Fuse-0805]  (value not drawn)
F3  SMD0805P020TF  [Fuse-0805]  (value not drawn)
F4  SMD0805P020TF  [Fuse-0805]  (value not drawn)
F5  SMD0805P020TF  [Fuse-0805]  (value not drawn)
F6  SMD0805P020TF  [Fuse-0805]  (value not drawn)
R33  4.7K  [Res-0402]  (value not drawn)
R34  4.7K  [Res-0402]  (value not drawn)
R35  4.7K  [Res-0402]  (value not drawn)
R36  4.7K  [Res-0402]
R37  4.7K  [Res-0402]
R38  22R  [Res-0201]
R39  22R  [Res-0201]
R40  4.7K  [Res-0402]
R41  120R  [Res-0603]
R42  22R  [Res-0201]
R43  22R  [Res-0201]
R44  4.7K  [Res-0402]  (value not drawn)
R45  4.7K  [Res-0402]  (value not drawn)
R46  4.7K  [Res-0402]  (value not drawn)
R47  4.7K  [Res-0402]
R48  4.7K  [Res-0402]
R49  22R  [Res-0201]
R50  22R  [Res-0201]
R51  4.7K  [Res-0402]
R52  120R  [Res-0603]
TP9  TEST POINT  [Test-point]  (value not drawn)  (no BOM)
TP10  TEST POINT  [Test-point]  (value not drawn)  (no BOM)
TP11  TEST POINT  [Test-point]  (value not drawn)  (no BOM)
TP12  TEST POINT  [Test-point]  (value not drawn)  (no BOM)
TP13  TEST POINT  [Test-point]  (value not drawn)  (no BOM)
U7  THVD2450DRBR  [SON-8-EP(3x3)]
U8  MAX3232ESE  [SOP-16]
U9  THVD2450DRBR  [SON-8-EP(3x3)]

### Ports
+3V3 (see Top_Sheet[3B], CAN_Sheet[5D], Controller_Sheet[5D], EtherCAT_Sheet[5D], Power_Sheet[5D], RJ45_Sheet[5D]), GND (see Top_Sheet[3C], CAN_Sheet[5D], Connector_Sheet[5D], Controller_Sheet[5D], EtherCAT_Sheet[5D], Power_Sheet[5D], Relay_Sheet[5D], RJ45_Sheet[5D]), RS232 (harness RS232, see Top_Sheet[4B], Controller_Sheet[4D]), RS232_RX (see Top_Sheet[4C], Connector_Sheet[2D]), RS232_TX (see Top_Sheet[4C], Connector_Sheet[2D]), RS485/2_N (see Top_Sheet[3C], Connector_Sheet[2D]), RS485/2_P (see Top_Sheet[3C], Connector_Sheet[2D]), RS485_N (see Top_Sheet[4C], Connector_Sheet[2D]), RS485_P (see Top_Sheet[4C], Connector_Sheet[2D]), RS-485 (harness RS-485, see Top_Sheet[4C], Controller_Sheet[4D]), RS-485/232_2 (harness RS-485/232_2, see Top_Sheet[4C], Controller_Sheet[3D])

### Harnesses
RS-485: TXD/RS485, RXD/RS485, RE/DE/RS485/T
RS-485/232_2: TXD/RS485_2, RXD/RS485_2, RE/DE/RS485/T_2
RS232: TXD/RS232, RXD/RS232

### Nets
+3V3: C33.2 C35.2 C39.2 R33.2 R34.2 R35.2 R36.2 R40.1 R44.2 R45.2 R46.2 R47.2 R51.1 U7.8(VCC) U8.16(VCC) U9.8(VCC) ; port +3V3
GND: C33.1 C35.1 C36.1 C37.1 C39.1 D9.1(A) D10.1(A) D11.1(A) D12.1(A) D13.1(A) D14.1(A) R37.2 R48.2 U7.5(GND) U7.9(EP) U8.15(GND) U9.5(GND) U9.9(EP) ; port GND
RE/DE/RS485/T: R45.1 R46.1 TP13.1 U9.2(RE#) U9.3(DE) ; port RS-485.RE/DE/RS485/T
RS232_RX: F3.1 TP9.1 ; port RS232_RX
RS232_TX: F4.1 TP10.1 ; port RS232_TX
RXD/RS485: R47.1 TP11.1 U9.4(D) ; port RS-485.RXD/RS485
TXD/RS485: R44.1 TP12.1 U9.1(R) ; port RS-485.TXD/RS485
BOARD_RS232_RX: U8.9(ROUT2) ; port RS232.RXD/RS232
BOARD_RS232_TX: U8.10(DIN2) ; port RS232.TXD/RS232
RE/DE/RS485/T_2: R34.1 R35.1 U7.2(RE#) U7.3(DE) ; port RS-485/232_2.RE/DE/RS485/T_2
RS485/2_N: F1.2 ; port RS485/2_N
RS485/2_P: F2.2 ; port RS485/2_P
RS485_N: F5.2 ; port RS485_N
RS485_P: F6.2 ; port RS485_P
RXD/RS485_2: R36.1 U7.4(D) ; port RS-485/232_2.RXD/RS485_2
TXD/RS485_2: R33.1 U7.1(R) ; port RS-485/232_2.TXD/RS485_2
NetC34_1: C34.1 U8.1(C1+)
NetC34_2: C34.2 U8.3(C1-)
NetC36_2: C36.2 U8.2(V+)
NetC37_2: C37.2 U8.6(V-)
NetC38_1: C38.1 U8.4(C2+)
NetC38_2: C38.2 U8.5(C2-)
NetD9_2: D9.2(K) F1.1 R38.2
NetD10_2: D10.2(K) F2.1 R39.2
NetD11_2: D11.2(K) F4.2 R43.1
NetD12_2: D12.2(K) F3.2 R42.1
NetD13_2: D13.2(K) F5.1 R49.2
NetD14_2: D14.2(K) F6.1 R50.2
NetR37_1: R37.1 R38.1 R41.1 U7.7(B)
NetR39_1: R39.1 R40.2 R41.2 U7.6(A)
NetR42_2: R42.2 U8.7(DOUT2)
NetR43_2: R43.2 U8.8(RIN2)
NetR48_1: R48.1 R49.1 R52.1 U9.7(B)
NetR50_1: R50.1 R51.2 R52.2 U9.6(A)

Not connected (* = marked no-connect by the designer): U8 11(DIN1)* 12(ROUT1)* 13(RIN1)* 14(DOUT1)*

### Layout directives
differential pair; net class RS485; differential pair class RS485_LINES; rule Impedance Constraint [Min = 115.0    Max = 125.0    ]; rule Matched Net Lengths [Tolerance = 0.508mm]: RS485/2_N, RS485/2_P, RS485_N, RS485_P

### Notes on the sheet
- RS485_2 TO UART
- RS232 TO UART
- RS485 TO UART
- (near TP9) TESTPOINTS
- File:
- Title:
- Date:
- Page
- Num:
- Total:
- Drawn By: Huzaifa Ali

### Library data of the parts
C33-C39 = GRM155R62A104KE14D: CAP CER 0.1UF 100V X5R 0402; Manufacturer: Murata; Capacitance: 100nF; Tolerance: 10%; Item Type: Capacitor; Supplier 1: Arrow Electronics; Manufacturer Part Number: GRM155R62A104KE14D; RoHS: Yes; Category: Ceramic Capacitors; Stock 1: 870000; Pricing 1: 10000=0.00500, 20000=0.00410, 30000=0.00390, 50000=0.00370, 100000=0.00300 (USD); Mount: Surface Mount; Case/Package: 0402; Case Code (Metric): 1005; Case Code (Imperial): 0402; Weight: 0.000212oz; Min Operating Temperature: -55°C; Max Operating Temperature: 85°C; Packaging: Tape and Reel; Voltage Rating: 100V; Dielectric: X5R; Termination: SMD/SMT; Voltage Rating (DC): 100V; Package Quantity: 10000; Series: GRM; Length: 0.039inch; Width: 0.02inch; Height: 0.5mm; Thickness: 0.022inch; Reach SVHC Compliant: Yes; Lead Free: Lead Free; RoHS Compliant: Yes; ComponentLink1URL: http://www.farnell.com/datasheets/2079151.pdf?src-supplier=Farnell; ComponentLink1Description: http://www.farnell.com/datasheets/2079151.pdf?src-supplier=Farnell; ComponentLink2URL: http://www.mouser.com/ds/2/281/c02e-2905.pdf?src-supplier=Mouser; ComponentLink2Description: http://www.mouser.com/ds/2/281/c02e-2905.pdf?src-supplier=Mouser; ComponentLink3URL: http://www.farnell.com/datasheets/2079151.pdf?src-supplier=Element14; ComponentLink3Description: http://www.farnell.com/datasheets/2079151.pdf?src-supplier=Element14; ComponentLink4URL: http://search.murata.co.jp/Ceramy/image/img/A01X/G101/ENG/GRM155R62A104KE14-01.pdf?src-supplier=Digi-Key; ComponentLink4Description: http://search.murata.co.jp/Ceramy/image/img/A01X/G101/ENG/GRM155R62A104KE14-01.pdf?src-supplier=Digi-Key; ComponentLink5URL: http://www.farnell.com/datasheets/2079151.pdf?src-supplier=Newark; ComponentLink5Description: http://www.farnell.com/datasheets/2079151.pdf?src-supplier=Newark; Supplier Part Number 1: GRM155R62A104KE14D; LCSC Part Number: C162178
D9-D14 = SMBJ26CA: SMB(DO-214AA) TVS ROHS; Manufacturer: MSKSEMI; Item Type: Diode; Manufacturer Part Number: SMBJ26CA; Package: SMB(DO-214AA); LCSC Part Number: C5331111; ComponentLink1Description: LCSC; ComponentLink1URL: https://www.lcsc.com/product-detail/TVS_MSKSEMI-SMBJ26CA_C5331111.html
F1-F6 = SMD0805P020TF: 9V 200mA 100A 500mA 0805 Resettable Fuses ROHS; Manufacturer: RUILON; Item Type: Fuse; Manufacturer Part Number: SMD0805P020TF; Package: 0805; LCSC Part Number: C20976; ComponentLink1Description: LCSC; ComponentLink1URL: https://www.lcsc.com/product-detail/Resettable-Fuses_RUILON-Shenzhen-Ruilongyuan-Elec-SMD0805P020TF_C20976.html
R33-R37 R40 R44-R48 R51 = RC0402FR-074K7L: RES 4.7K OHM 1% 1/16W 0402; Manufacturer: Yageo; Voltage Rating (DC): 50V; Power Rating: 62.5mW; Resistance: 4.7kR; Temperature Coefficient: 100ppm/°C; Max Power Dissipation: 63mW; Item Type: Resistor; Supplier 1: Avnet; Manufacturer Part Number: RC0402FR-074K7L; RoHS: Yes; Category: Chip SMD Resistors; Stock 1: 2420000; Pricing 1: 10000=0.00085 (USD); Case/Package: 0402; Number of Pins: 2; Case Code (Imperial): 0402; Case Code (Metric): 1005; Size Code: 0402; Min Operating Temperature: -55°C; Max Operating Temperature: 155°C; Tolerance: 1%; Voltage Rating: 50V; Packaging: Tape and Reel; Resistor Type: Thick Film; Termination: SMD/SMT; Features: Moisture Resistant; Series: RC; Number of Terminations: 2; Resistance Tolerance: 1%; Construction: Rectangular; Length: 1mm; Width: 0.5mm; Height: 0.32mm; Depth: 0.5mm; Height - Seated (Max): 0.016inch; RoHS Compliant: Yes; Reach SVHC Compliant: Yes; Military Standard: Not; Lead Free: Lead Free; ComponentLink1URL: https://datasheet.ciiva.com/22661/1686128-22661342.pdf?src-supplier=Element14; ComponentLink1Description: https://datasheet.ciiva.com/22661/1686128-22661342.pdf?src-supplier=Element14; ComponentLink2URL: https://datasheet.ciiva.com/7850/1018594-7850022.pdf?src-supplier=Element14; ComponentLink2Description: https://datasheet.ciiva.com/7850/1018594-7850022.pdf?src-supplier=Element14; ComponentLink3URL: https://datasheet.ciiva.com/7850/1018594-7850023.pdf?src-supplier=Element14; ComponentLink3Description: https://datasheet.ciiva.com/7850/1018594-7850023.pdf?src-supplier=Element14; ComponentLink4URL: https://datasheet.ciiva.com/15215/getdatasheetpartid-328119-15215035.pdf?src-supplier=Verical; ComponentLink4Description: https://datasheet.ciiva.com/15215/getdatasheetpartid-328119-15215035.pdf?src-supplier=Verical; Supplier Part Number 1: RC0402FR-074K7L; LCSC Part Number: C105871
R38 R39 R42 R43 R49 R50 = RC0201FR-0722RL: RES 22 OHM 1% 1/20W 0201; Manufacturer: Yageo; Item Type: Resistor; Supplier: Future Electronics; Supplier Part Number: 5973409; Manufacturer Part Number: RC0201FR-0722RL; RoHS: Yes; Category: Chip SMD Resistors; Stock: 17980000; Pricing: 10000=0.0014, 50000=0.0013, 250000=0.0013, 750000=0.0012, 2000000=0.0011 (USD); ComponentLink1URL: https://datasheet.ciiva.com/7672/1563626-7672215.pdf?src-supplier=Element14; ComponentLink1Description: https://datasheet.ciiva.com/7672/1563626-7672215.pdf?src-supplier=Element14; LCSC Part Number: C155743
R41 R52 = RC0603JR-07120RL: RES 120 OHM 5% 1/10W 0603; Manufacturer: Yageo; Voltage Rating (AC): 50V; Item Type: Resistor; Supplier: Future Electronics; Supplier Part Number: 4045720; Manufacturer Part Number: RC0603JR-07120RL; RoHS: Yes; Category: Chip SMD Resistors; Stock: 570000; Pricing: 5000=0.0015, 75000=0.0015, 250000=0.0014, 750000=0.0013, 2500000=0.0012 (USD); ComponentLink1URL: https://datasheet.ciiva.com/15189/getdatasheetpartid-326532-15189850.pdf?src-supplier=Verical; ComponentLink1Description: https://datasheet.ciiva.com/15189/getdatasheetpartid-326532-15189850.pdf?src-supplier=Verical; ComponentLink2URL: https://datasheet.ciiva.com/2518/pyu-r-int-thick-7-2518850.pdf?src-supplier=Digi-Key; ComponentLink2Description: https://datasheet.ciiva.com/2518/pyu-r-int-thick-7-2518850.pdf?src-supplier=Digi-Key; ComponentLink3URL: https://datasheet.ciiva.com/2518/pyu-r-int-thick-7-2518851.pdf?src-supplier=Digi-Key; ComponentLink3Description: https://datasheet.ciiva.com/2518/pyu-r-int-thick-7-2518851.pdf?src-supplier=Digi-Key; ComponentLink4URL: https://datasheet.ciiva.com/2518/pyu-r-int-thick-7-2518852.pdf?src-supplier=Digi-Key; ComponentLink4Description: https://datasheet.ciiva.com/2518/pyu-r-int-thick-7-2518852.pdf?src-supplier=Digi-Key; ComponentLink5URL: https://datasheet.ciiva.com/46395/443971-46395070.pdf?src-supplier=Element14; ComponentLink5Description: https://datasheet.ciiva.com/46395/443971-46395070.pdf?src-supplier=Element14; ComponentLink6URL: https://datasheet.ciiva.com/12555/rc0603-272842-12555246.pdf?src-supplier=Mouser; ComponentLink6Description: https://datasheet.ciiva.com/12555/rc0603-272842-12555246.pdf?src-supplier=Mouser; LCSC Part Number: C114681
TP9-TP13 = TEST POINT: Test Point ON; Item Type: TEST POINT
U7 U9 = THVD2450DRBR: IC TRANSCEIVER HALF 1/1 8SON; Manufacturer: Texas Instruments; Supplier: Digikey; Supplier Part Number: 296-THVD2450DRBRCT-ND; Manufacturer Part Number: THVD2450DRBR; RoHS: Yes; Item Type: IC; Stock: 2652; Pricing: 1=4.05, 10=3.639, 25=3.4404, 100=2.9818, 250=2.82892, 500=2.53838, 1000=2.1408 (USD); Pins: 8NUMBER; Length: 3mm; Width: 3mm; Height: 1mm; Thickness: 880um; LCSC Part Number: C2878080
U8 = MAX3232ESE: 250Kbps transceiver 2/2 SOP-16 RS232 ICs ROHS; Manufacturer: UMW; Item Type: IC; Manufacturer Part Number: MAX3232ESE; Package: SOP-16; LCSC Part Number: C2904738; ComponentLink1Description: LCSC; ComponentLink1URL: https://www.lcsc.com/product-detail/RS232-ICs_UMW-Youtai-Semiconductor-Co-Ltd-MAX3232ESE_C2904738.html

## Sheet RJ45_Sheet.SchDoc
size 420 x 297 mm; SheetNumber: 7; SheetTotal: 10
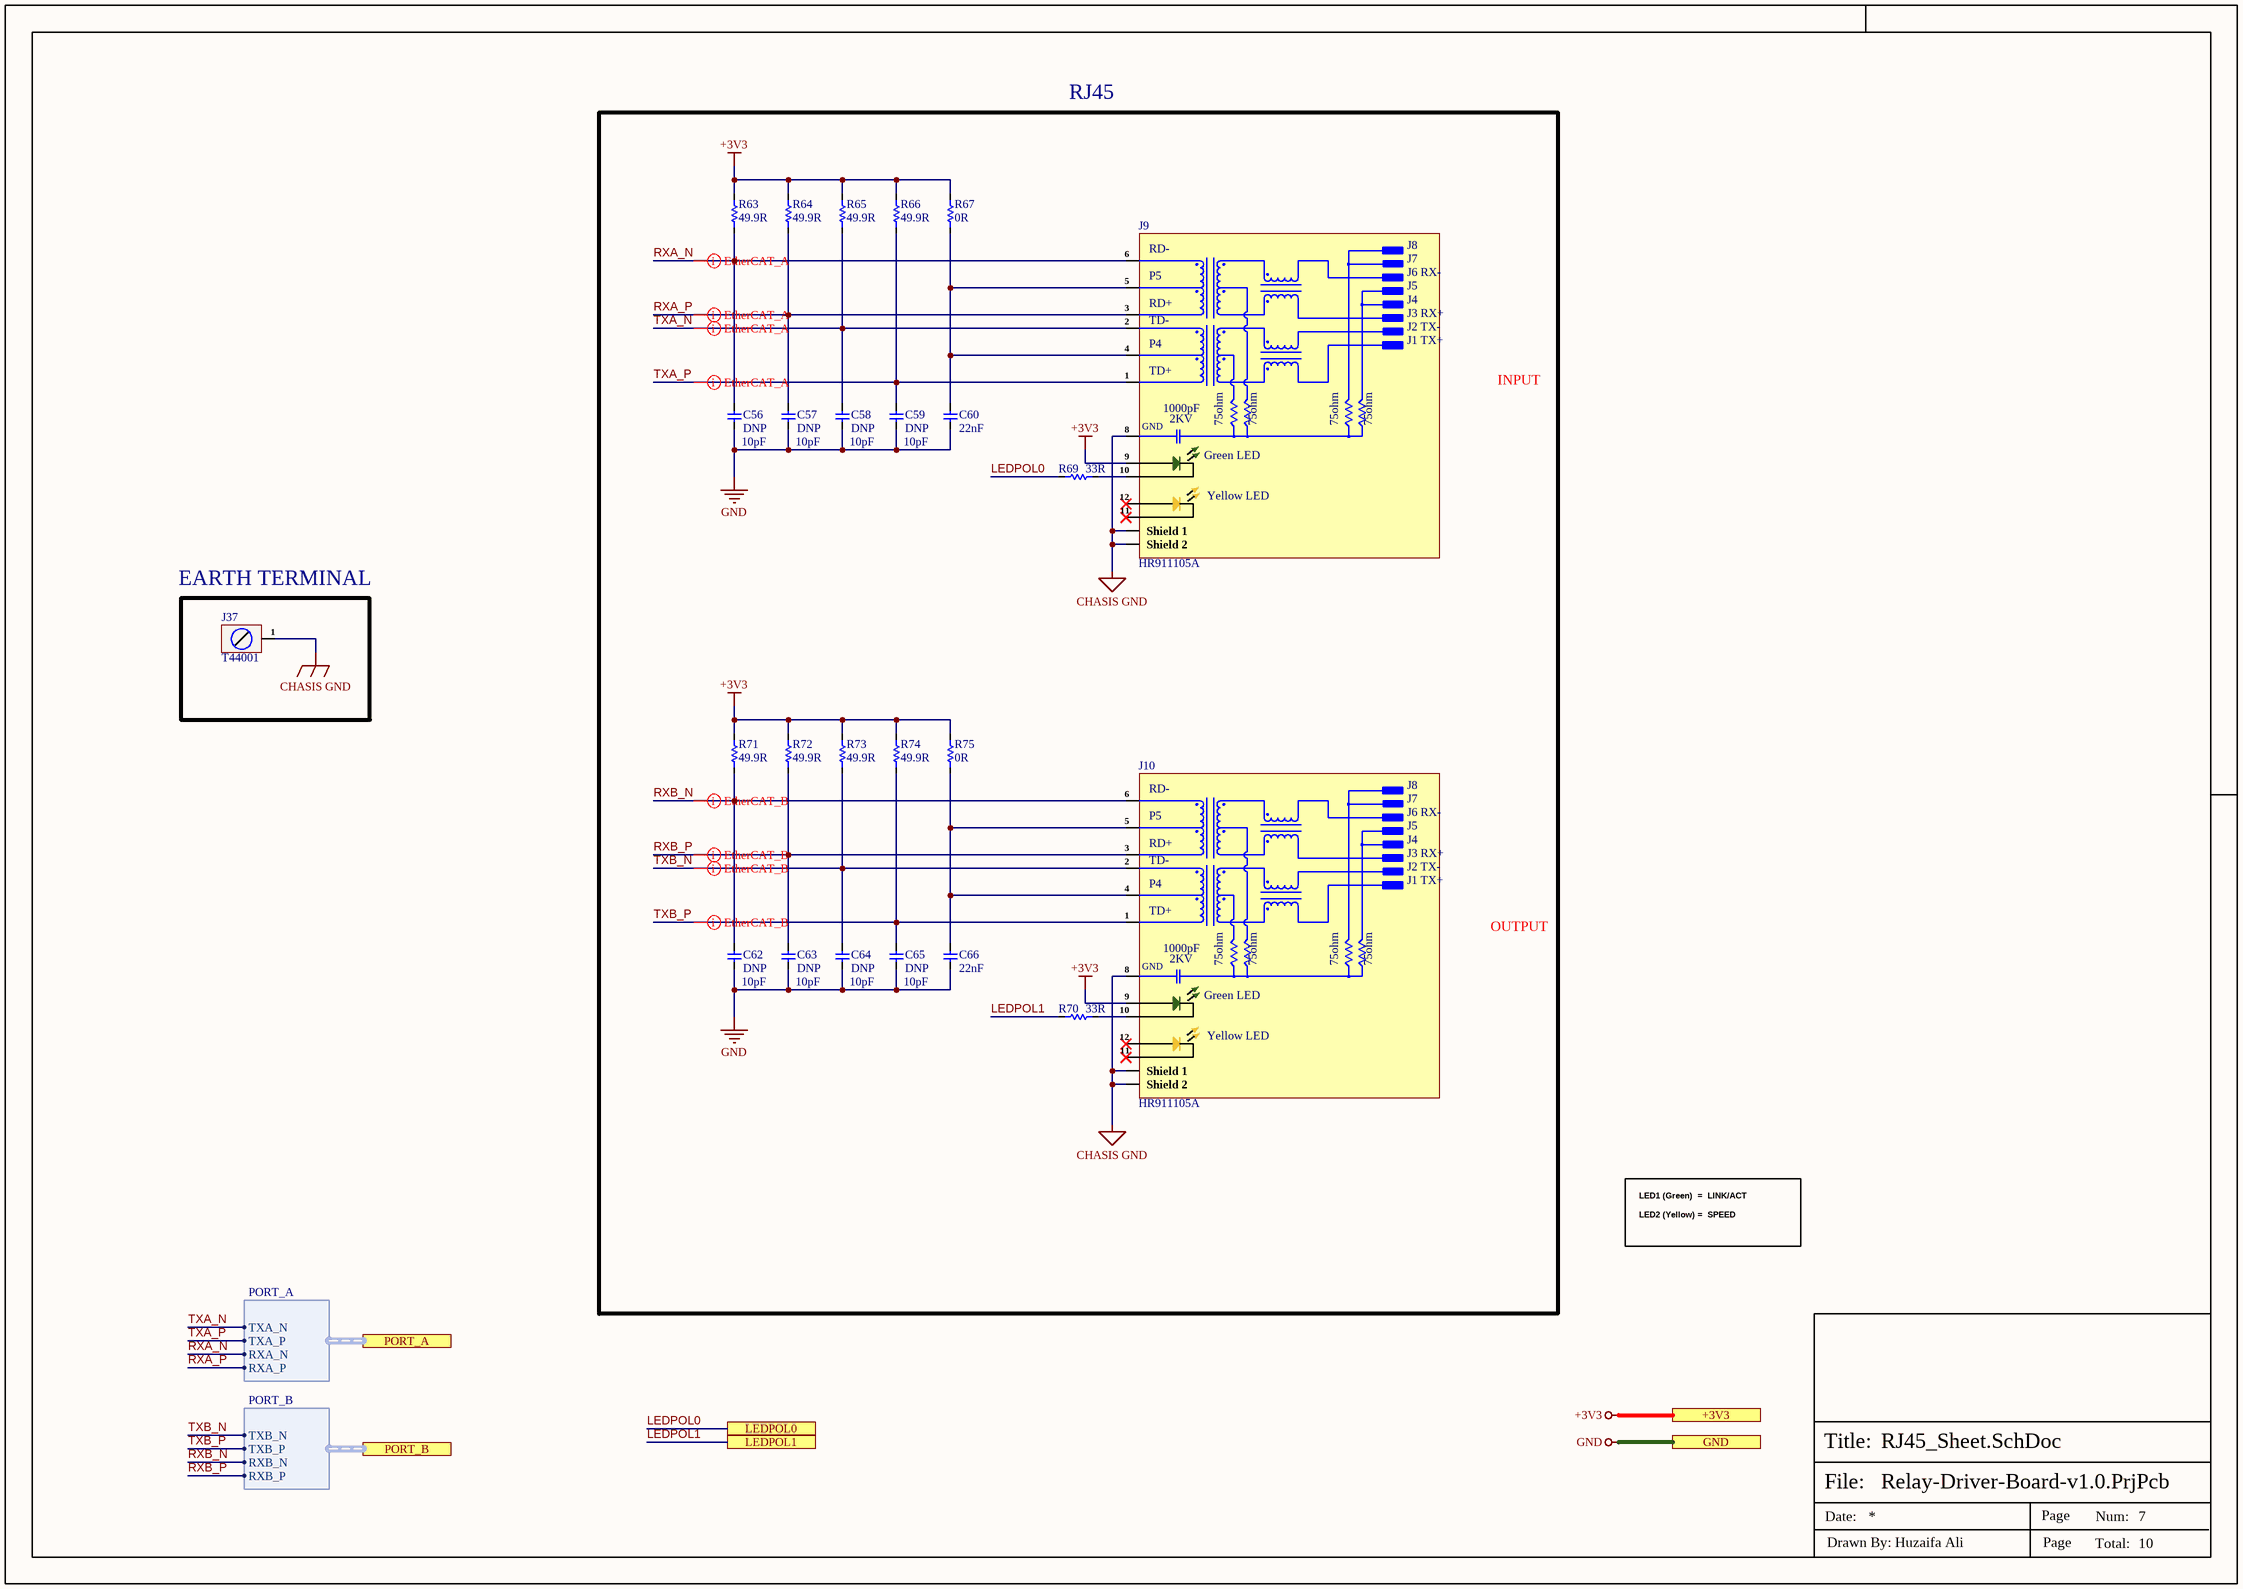
[diagram p9: RJ45_Sheet.SchDoc]

### Parts
C56  DNP  [Cap-0402]
C57  DNP  [Cap-0402]
C58  DNP  [Cap-0402]
C59  DNP  [Cap-0402]
C60  22nF  [Cap-0402]
C62  DNP  [Cap-0402]
C63  DNP  [Cap-0402]
C64  DNP  [Cap-0402]
C65  DNP  [Cap-0402]
C66  22nF  [Cap-0402]
J9  HR911105A  [HR911105A]
J10  HR911105A  [HR911105A]
J37  T44001  [T44001]
R63  49.9R  [Res-0603]
R64  49.9R  [Res-0603]
R65  49.9R  [Res-0603]
R66  49.9R  [Res-0603]
R67  0R  [Res-0402]
R69  33R  [Res-0402]
R70  33R  [Res-0402]
R71  49.9R  [Res-0603]
R72  49.9R  [Res-0603]
R73  49.9R  [Res-0603]
R74  49.9R  [Res-0603]
R75  0R  [Res-0402]

### Ports
+3V3 (see Top_Sheet[6A], CAN_Sheet[5D], Controller_Sheet[5D], EtherCAT_Sheet[5D], Power_Sheet[5D], RS485_RS232_Sheet[5D]), GND (see Top_Sheet[6A], CAN_Sheet[5D], Connector_Sheet[5D], Controller_Sheet[5D], EtherCAT_Sheet[5D], Power_Sheet[5D], Relay_Sheet[5D], RS485_RS232_Sheet[5D]), LEDPOL0 (see Top_Sheet[6A], EtherCAT_Sheet[2D]), LEDPOL1 (see Top_Sheet[6A], EtherCAT_Sheet[2D]), PORT_A (harness PORT_A, see Top_Sheet[6A], EtherCAT_Sheet[3D]), PORT_B (harness PORT_B, see Top_Sheet[6A], EtherCAT_Sheet[3D])

### Harnesses
PORT_A: TXA_N, TXA_P, RXA_N, RXA_P
PORT_B: TXB_N, TXB_P, RXB_N, RXB_P

### Nets
+3V3: J9.9(ANODE) J10.9(ANODE) R63.2 R64.2 R65.2 R66.2 R67.2 R71.2 R72.2 R73.2 R74.2 R75.2 ; port +3V3
CHASIS GND: J9.8(GND) J9.Shield_1 J9.Shield_2 J10.8(GND) J10.Shield_1 J10.Shield_2 J37.1
GND: C56.1 C57.1 C58.1 C59.1 C60.1 C62.1 C63.1 C64.1 C65.1 C66.1 ; port GND
LEDPOL0: R69.1 ; port LEDPOL0
LEDPOL1: R70.1 ; port LEDPOL1
RXA_N: C56.2 J9.6(RD-) R63.1 ; port PORT_A.RXA_N
RXA_P: C57.2 J9.3(RD+) R64.1 ; port PORT_A.RXA_P
RXB_N: C62.2 J10.6(RD-) R71.1 ; port PORT_B.RXB_N
RXB_P: C63.2 J10.3(RD+) R72.1 ; port PORT_B.RXB_P
TXA_N: C58.2 J9.2(TD-) R65.1 ; port PORT_A.TXA_N
TXA_P: C59.2 J9.1(TD+) R66.1 ; port PORT_A.TXA_P
TXB_N: C64.2 J10.2(TD-) R73.1 ; port PORT_B.TXB_N
TXB_P: C65.2 J10.1(TD+) R74.1 ; port PORT_B.TXB_P
NetC60_2: C60.2 J9.4(P4) J9.5(P5) R67.1
NetC66_2: C66.2 J10.4(P4) J10.5(P5) R75.1
NetJ9_10: J9.10(CATHODE) R69.2
NetJ10_10: J10.10(CATHODE) R70.2

Not connected (* = marked no-connect by the designer): J9 11(CATHODE)* 12(ANODE_)*; J10 11(CATHODE)* 12(ANODE_)*

### Layout directives
differential pair; differential pair class EtherCAT_B_Lines; net class EtherCAT_B; rule Matched Net Lengths [Tolerance = 25.4mil]; rule Impedance Constraint [Min = 85.00    Max = 95.00    ]: RXB_N, RXB_P, TXB_N, TXB_P
differential pair; differential pair class EtherCAT_A_Lines; net class EtherCAT_A; rule Matched Net Lengths [Tolerance = 25.4mil]; rule Impedance Constraint [Min = 85.00    Max = 95.00    ]: RXA_N, RXA_P, TXA_N, TXA_P

### Notes on the sheet
- RJ45
- INPUT
- 10pF
- (near J37) EARTH TERMINAL
- OUTPUT
- LED1 (Green)  =  LINK/ACT
  LED2 (Yellow) =  SPEED
- File:
- Title:
- Date:
- Page
- Num:
- Total:
- Drawn By: Huzaifa Ali
- (in symbol HR911105A) J8; J7; J6 RX-; J5; J4; J3 RX+; J2 TX-; J1 TX+; 1000pF; 2KV; 75ohm; Green LED; Yellow LED

### Library data of the parts
C56-C59 C62-C65 = GRM1555C1H100JA01D: CAP CER 10PF 50V C0G/NP0 0402; Manufacturer: Murata; Material: Ceramic; Dielectric: C0G; Tolerance: 5%; Item Type: Capacitor; Supplier: Arrow Electronics; Supplier Part Number: GRM1555C1H100JA01D; Manufacturer Part Number: GRM1555C1H100JA01D; RoHS: Yes; Category: Ceramic Capacitors; Stock: 3860000; Pricing: 10000=0.0034, 50000=0.0027, 100000=0.0023, 250000=0.0021 (USD); Mounting Technology: Surface Mount; Case/Package: 0402; Case Code (Metric): 1005; Case Code (Imperial): 0402; Min Operating Temperature: -55°C; Max Operating Temperature: 125°C; Value: 10pF; Voltage Rating: 50V; Packaging: Tape and Reel; Package Quantity: 1; Voltage Rating (DC): 50V; Termination: SMD/SMT; Series: GRM; Voltage: 50V; Construction: Flat; Length: 1mm; Width: 0.02inch; Height: 0.5mm; Depth: 0.5mm; Thickness: 0.022inch; Radiation Hardening: No; RoHS Compliant: Yes; Lead Free: Lead Free; Reach SVHC Compliant: No; ComponentLink1URL: https://datasheet.ciiva.com/2989/product-2989280.pdf?src-supplier=Avnet; ComponentLink1Description: https://datasheet.ciiva.com/2989/product-2989280.pdf?src-supplier=Avnet; ComponentLink2URL: https://datasheet.ciiva.com/18184/getdatasheetpartid-307234-18184164.pdf?src-supplier=Verical; ComponentLink2Description: https://datasheet.ciiva.com/18184/getdatasheetpartid-307234-18184164.pdf?src-supplier=Verical; ComponentLink3URL: https://datasheet.ciiva.com/29200/453545-da-01-en-vs-kondensator-0402-29200107.pdf?src-supplier=Conrad; ComponentLink3Description: https://datasheet.ciiva.com/29200/453545-da-01-en-vs-kondensator-0402-29200107.pdf?src-supplier=Conrad; ComponentLink4URL: https://datasheet.ciiva.com/7828/1666664-7828812.pdf?src-supplier=Element14; ComponentLink4Description: https://datasheet.ciiva.com/7828/1666664-7828812.pdf?src-supplier=Element14; ComponentLink5URL: https://datasheet.ciiva.com/6271/partnumbering-e-01-6271159.pdf?src-supplier=Digi-Key; ComponentLink5Description: https://datasheet.ciiva.com/6271/partnumbering-e-01-6271159.pdf?src-supplier=Digi-Key; ComponentLink6URL: https://datasheet.ciiva.com/6271/partnumbering-e-01-6271158.pdf?src-supplier=Digi-Key; ComponentLink6Description: https://datasheet.ciiva.com/6271/partnumbering-e-01-6271158.pdf?src-supplier=Digi-Key; ComponentLink7URL: https://datasheet.ciiva.com/6271/partnumbering-e-01-6271068.pdf?src-supplier=Digi-Key; ComponentLink7Description: https://datasheet.ciiva.com/6271/partnumbering-e-01-6271068.pdf?src-supplier=Digi-Key; LCSC Part Number: C76946
C60 C66 = CC0402JRX7R7BB223: CAP CER 0.022UF 16V X7R 0402; Manufacturer: Yageo; Tolerance: 5%; Item Type: Capacitor; Supplier: Digikey; Supplier Part Number: 311-3758-1-ND; Manufacturer Part Number: CC0402JRX7R7BB223; RoHS: Yes; Category: Ceramic Capacitors; Stock: 4203; Pricing: 1=0.1, 10=0.033, 50=0.0192, 100=0.0149, 500=0.0112, 1000=0.0088, 2500=0.008, 5000=0.00736 (USD); Mounting Technology: Surface Mount; Case/Package: 0402; Case Code (Imperial): 0402; Case Code (Metric): 1005; Weight: 2.3E-05oz; Min Operating Temperature: -55°C; Max Operating Temperature: 125°C; Value: 22nF; Packaging: Tape and Reel; Voltage Rating: 16V; Voltage Rating (DC): 16V; Dielectric: X7R; Termination: SMD/SMT; Series: CC; Length: 0.039inch; Width: 0.5mm; Thickness: 0.022inch; RoHS Compliant: Yes; Halogen Free: 5694HalogenFree; Lead Free: 5697LeadFree; ComponentLink1URL: https://datasheet.ciiva.com/13264/upy-gphc-x7r-6-3v-to-50v-8-12304-13264039.pdf?src-supplier=Mouser; ComponentLink1Description: https://datasheet.ciiva.com/13264/upy-gphc-x7r-6-3v-to-50v-8-12304-13264039.pdf?src-supplier=Mouser; LCSC Part Number: C541459
J9 J10 = HR911105A: RJ45 RJReceptacle 1 WithLED Plugin Ethernet Connectors/Modular Connectors (RJ45 RJ11) ROHS; Manufacturer: HANRUN; Item Type: RJ45 Connector; Manufacturer Part Number: HR911105A; Package: Plugin; LCSC Part Number: C12074; ComponentLink1Description: LCSC; ComponentLink1URL: https://www.lcsc.com/product-detail/Ethernet-Connectors-Modular-Connectors-RJ45-RJ11_HANRUN-Zhongshan-HanRun-Elec-HR911105A_C12074.html
J37 = T44001: M4 Plugin PCB Welding Terminal ROHS; Manufacturer: XFCN; Manufacturer Part Number: T44001; Package: Plugin; ComponentLink1Description: LCSC; ComponentLink1URL: *
R63-R66 R71-R74 = RC0603FR-0749R9L: RES 49.9 OHM 1% 1/10W 0603; Manufacturer: Yageo; Temperature Coefficient: 100ppm/°C; Voltage Rating (DC): 50V; Power Rating: 100mW; Item Type: Resistor; Supplier 1: Arrow Electronics; Manufacturer Part Number: RC0603FR-0749R9L; RoHS: Yes; Category: Chip SMD Resistors; Stock 1: 2075000; Pricing 1: 5000=0.00280 (USD); Case/Package: 0603; Number of Pins: 2; Case Code (Imperial): 0603; Case Code (Metric): 1608; Size Code: 0603; Min Operating Temperature: -55°C; Max Operating Temperature: 155°C; Tolerance: 1%; Resistance: 49.9R; Resistor Type: Thick Film; Packaging: Tape and Reel; Voltage Rating: 50V; Termination: SMD/SMT; Features: Moisture Resistant; Series: RC; Max Power Dissipation: 100mW; Number of Terminations: 2; Construction: Rectangular; Resistance Tolerance: 1%; Technology: THICK FILM; Length: 1.6mm; Height: 0.45mm; Depth: 0.8mm; Lead Free: Lead Free; REACH SVHC: No SVHC; Military Standard: Not; RoHS Compliant: Yes; ComponentLink1URL: https://datasheet.ciiva.com/11808/0900766b80f96399-11808223.pdf?src-supplier=RSComponents; ComponentLink1Description: https://datasheet.ciiva.com/11808/0900766b80f96399-11808223.pdf?src-supplier=RSComponents; ComponentLink2URL: https://datasheet.ciiva.com/22747/443971-22747527.pdf?src-supplier=Element14; ComponentLink2Description: https://datasheet.ciiva.com/22747/443971-22747527.pdf?src-supplier=Element14; ComponentLink3URL: https://datasheet.ciiva.com/15189/getdatasheetpartid-325421-15189750.pdf?src-supplier=Verical; ComponentLink3Description: https://datasheet.ciiva.com/15189/getdatasheetpartid-325421-15189750.pdf?src-supplier=Verical; Supplier Part Number 1: RC0603FR-0749R9L; LCSC Part Number: C114625
R67 R75 = AC0402FR-070RL: RESISTOR 0402 JUMPER ZERO OHM; Manufacturer: Yageo; Voltage Rating: 50V; Power Rating: 62.5mW; Tolerance: 1%; Temperature Coefficient: 200ppm/°C; Supplier: Digi-Key; Supplier Part Number: 13-AC0402FR-070RLDKR-ND; Manufacturer Part Number: AC0402FR-070RL; RoHS: Yes; Category: Chip SMD Resistors; Stock: 337140; Pricing: 1=0.1, 10=0.017, 25=0.0132, 50=0.01, 100=0.0071, 250=0.00568, 500=0.00454, 1000=0.00335, 5000=0.0024 (USD); Case/Package: 0402; Case Code (Imperial): 0402; Case Code (Metric): 1005; Min Operating Temperature: -55°C; Max Operating Temperature: 155°C; Value: 0R; Packaging: Tape and Reel; Termination: SMD/SMT; Series: AC; Height: 370um; ComponentLink1URL: https://datasheet.ciiva.com/12656/pyu-ac-51-rohs-l-2-12656734.pdf?src-supplier=Mouser; ComponentLink1Description: https://datasheet.ciiva.com/12656/pyu-ac-51-rohs-l-2-12656734.pdf?src-supplier=Mouser; LCSC Part Number: C226739; Item Type: Resistor; ComponentLink2Description: LCSC; ComponentLink2URL: https://www.lcsc.com/product-detail/Chip-Resistor-Surface-Mount_YAGEO-AC0402FR-070RL_C226739.html
R69 R70 = RC0402FR-0733RL: RES 33 OHM 1% 1/16W 0402; Manufacturer: Yageo; Power Rating: 62.5mW; Voltage Rating: 50V; Temperature Coefficient: 100ppm/°C; Max Power Dissipation: 63mW; Supplier 1: Mouser; Manufacturer Part Number: RC0402FR-0733RL; RoHS: Yes; Category: Chip SMD Resistors; Stock 1: 1843488; Pricing 1: 1=0.10000, 10=0.01200, 50=0.01200, 100=0.00500, 1000=0.00300, 10000=0.00100 (USD); Case/Package: 0402; Number of Pins: 2; Case Code (Imperial): 0402; Case Code (Metric): 1005; Size Code: 0402; Min Operating Temperature: -55°C; Max Operating Temperature: 155°C; Resistor Type: Thick Film; Resistance: 33R; Tolerance: 1%; Packaging: Tape and Reel; Voltage Rating (DC): 50V; Package Quantity: 10000; Termination: SMD/SMT; Features: Moisture Resistant; Series: RC; Number of Terminations: 2; Resistance Tolerance: 1%; Construction: Rectangular; Technology: THICK FILM; Length: 1mm; Width: 0.5mm; Height: 0.35mm; Depth: 0.5mm; RoHS Compliant: Yes; REACH SVHC: Unknown; Military Standard: Not; Lead Free: Lead Free; ComponentLink1URL: https://datasheet.ciiva.com/11819/0900766b80c66297-11819487.pdf?src-supplier=RSComponents; ComponentLink1Description: https://datasheet.ciiva.com/11819/0900766b80c66297-11819487.pdf?src-supplier=RSComponents; ComponentLink2URL: https://datasheet.ciiva.com/24070/pyu-rc0402-51-rohs-l-6-r-8721-24070077.pdf?src-supplier=Mouser; ComponentLink2Description: https://datasheet.ciiva.com/24070/pyu-rc0402-51-rohs-l-6-r-8721-24070077.pdf?src-supplier=Mouser; ComponentLink3URL: https://datasheet.ciiva.com/7849/1018594-7849967.pdf?src-supplier=Element14; ComponentLink3Description: https://datasheet.ciiva.com/7849/1018594-7849967.pdf?src-supplier=Element14; ComponentLink4URL: https://datasheet.ciiva.com/7849/1018594-7849966.pdf?src-supplier=Element14; ComponentLink4Description: https://datasheet.ciiva.com/7849/1018594-7849966.pdf?src-supplier=Element14; ComponentLink5URL: https://datasheet.ciiva.com/15189/getdatasheetpartid-329253-15189431.pdf?src-supplier=Verical; ComponentLink5Description: https://datasheet.ciiva.com/15189/getdatasheetpartid-329253-15189431.pdf?src-supplier=Verical; ComponentLink6URL: https://datasheet.ciiva.com/17070/pyu-rc0402-51-rohs-l-6-r-17070335.pdf?src-supplier=Future+Electronics; ComponentLink6Description: https://datasheet.ciiva.com/17070/pyu-rc0402-51-rohs-l-6-r-17070335.pdf?src-supplier=Future+Electronics; Supplier Part Number 1: 603-RC0402FR-0733RL; LCSC Part Number: C138002

## Nets that join several sheets
+3V3: CAN_Sheet (C31.2 U6.5), Controller_Sheet (10 pins), EtherCAT_Sheet (19 pins), Power_Sheet (5 pins), RS485_RS232_Sheet (16 pins), RJ45_Sheet (12 pins)
+5V: CAN_Sheet (5 pins), Power_Sheet (7 pins)
+12V: Power_Sheet (6 pins), Relay_PWR_Sheet (16 pins)
+24V: Connector_Sheet (D15.2 J29.2), Power_Sheet (19 pins), Relay_PWR_Sheet (16 pins), Relay_Sheet (35 pins)
+48V: Power_Sheet (6 pins), Relay_PWR_Sheet (16 pins)
CAN_RX: CAN_Sheet (TP7.1 U6.4), Controller_Sheet (U5.15)
CAN_TX: CAN_Sheet (TP8.1 U6.1), Controller_Sheet (U5.16)
GND: CAN_Sheet (7 pins), Connector_Sheet (19 pins), Controller_Sheet (27 pins), EtherCAT_Sheet (26 pins), Power_Sheet (50 pins), Relay_Sheet (U11.8 U12.8 U13.8), RS485_RS232_Sheet (18 pins), RJ45_Sheet (10 pins)
RE/DE/RS485/T: Controller_Sheet (U5.20), RS485_RS232_Sheet (5 pins)
RS232_RX: Connector_Sheet (J32.1), RS485_RS232_Sheet (F3.1 TP9.1)
RS232_TX: Connector_Sheet (J32.2), RS485_RS232_Sheet (F4.1 TP10.1)
RXD/RS485: Controller_Sheet (U5.21), RS485_RS232_Sheet (R47.1 TP11.1 U9.4)
TXD/RS485: Controller_Sheet (U5.22), RS485_RS232_Sheet (R44.1 TP12.1 U9.1)
BOARD_RS232_RX: Controller_Sheet (U5.56), RS485_RS232_Sheet (U8.9)
BOARD_RS232_TX: Controller_Sheet (U5.55), RS485_RS232_Sheet (U8.10)
CAN_N: CAN_Sheet (R32.2 U6.12), Connector_Sheet (J27.2)
CAN_P: CAN_Sheet (R30.1 U6.13), Connector_Sheet (J27.1)
CONN1: Connector_Sheet (J33.1), Relay_Sheet (K1.5)
CONN2: Connector_Sheet (J33.3), Relay_Sheet (K2.5)
CONN3: Connector_Sheet (J33.5), Relay_Sheet (K3.5)
CONN4: Connector_Sheet (J33.7), Relay_Sheet (K4.5)
CONN5: Connector_Sheet (J35.1), Relay_Sheet (K5.5)
CONN6: Connector_Sheet (J35.3), Relay_Sheet (K6.5)
CONN7: Connector_Sheet (J35.5), Relay_Sheet (K7.5)
CONN8: Connector_Sheet (J35.7), Relay_Sheet (K8.5)
CONN9: Connector_Sheet (J34.1), Relay_Sheet (K9.5)
CONN10: Connector_Sheet (J34.3), Relay_Sheet (K10.5)
CONN11: Connector_Sheet (J34.5), Relay_Sheet (K11.5)
CONN12: Connector_Sheet (J34.7), Relay_Sheet (K12.5)
CONN13: Connector_Sheet (J36.1), Relay_Sheet (K13.5)
CONN14: Connector_Sheet (J36.3), Relay_Sheet (K14.5)
CONN15: Connector_Sheet (J36.5), Relay_Sheet (K15.5)
CONN16: Connector_Sheet (J36.7), Relay_Sheet (K16.5)
EN_CAN: CAN_Sheet (U6.6), Controller_Sheet (U5.58)
INH_MASK: CAN_Sheet (U6.11), Controller_Sheet (U5.57)
LEDPOL0: EtherCAT_Sheet (R58.2 U10.48), RJ45_Sheet (R69.1)
LEDPOL1: EtherCAT_Sheet (R59.2 U10.46), RJ45_Sheet (R70.1)
nFAULT_CAN: CAN_Sheet (U6.8), Controller_Sheet (U5.60)
nSTB_CAN: CAN_Sheet (U6.14), Controller_Sheet (U5.59)
PWR1: Relay_PWR_Sheet (J11.1 J11.3 J11.5), Relay_Sheet (K1.2)
PWR2: Relay_PWR_Sheet (J12.1 J12.3 J12.5), Relay_Sheet (K2.2)
PWR3: Relay_PWR_Sheet (J13.1 J13.3 J13.5), Relay_Sheet (K3.2)
PWR4: Relay_PWR_Sheet (J14.1 J14.3 J14.5), Relay_Sheet (K4.2)
PWR5: Relay_PWR_Sheet (J15.1 J15.3 J15.5), Relay_Sheet (K5.2)
PWR6: Relay_PWR_Sheet (J16.1 J16.3 J16.5), Relay_Sheet (K6.2)
PWR7: Relay_PWR_Sheet (J17.1 J17.3 J17.5), Relay_Sheet (K7.2)
PWR8: Relay_PWR_Sheet (J18.1 J18.3 J18.5), Relay_Sheet (K8.2)
PWR9: Relay_PWR_Sheet (J19.1 J19.3 J19.5), Relay_Sheet (K9.2)
PWR10: Relay_PWR_Sheet (J20.1 J20.3 J20.5), Relay_Sheet (K10.2)
PWR11: Relay_PWR_Sheet (J21.1 J21.3 J21.5), Relay_Sheet (K11.2)
PWR12: Relay_PWR_Sheet (J22.1 J22.3 J22.5), Relay_Sheet (K12.2)
PWR13: Relay_PWR_Sheet (J23.1 J23.3 J23.5), Relay_Sheet (K13.2)
PWR14: Relay_PWR_Sheet (J24.1 J24.3 J24.5), Relay_Sheet (K14.2)
PWR15: Relay_PWR_Sheet (J25.1 J25.3 J25.5), Relay_Sheet (K15.2)
PWR16: Relay_PWR_Sheet (J26.1 J26.3 J26.5), Relay_Sheet (K16.2)
RE/DE/RS485/T_2: Controller_Sheet (U5.19), RS485_RS232_Sheet (R34.1 R35.1 U7.2 U7.3)
RELAY1: Controller_Sheet (U5.23), Relay_Sheet (U11.1)
RELAY2: Controller_Sheet (U5.24), Relay_Sheet (U11.2)
RELAY3: Controller_Sheet (U5.25), Relay_Sheet (U11.3)
RELAY4: Controller_Sheet (U5.26), Relay_Sheet (U11.4)
RELAY5: Controller_Sheet (U5.27), Relay_Sheet (U11.5)
RELAY6: Controller_Sheet (U5.28), Relay_Sheet (U11.6)
RELAY7: Controller_Sheet (U5.29), Relay_Sheet (U11.7)
RELAY8: Controller_Sheet (U5.30), Relay_Sheet (U12.1)
RELAY9: Controller_Sheet (U5.31), Relay_Sheet (U12.2)
RELAY10: Controller_Sheet (U5.32), Relay_Sheet (U12.3)
RELAY11: Controller_Sheet (U5.33), Relay_Sheet (U12.4)
RELAY12: Controller_Sheet (U5.34), Relay_Sheet (U12.5)
RELAY13: Controller_Sheet (U5.35), Relay_Sheet (U12.6)
RELAY14: Controller_Sheet (U5.36), Relay_Sheet (U12.7)
RELAY15: Controller_Sheet (U5.38), Relay_Sheet (U13.1)
RELAY16: Controller_Sheet (U5.39), Relay_Sheet (U13.2)
RS485/2_N: Connector_Sheet (J31.1), RS485_RS232_Sheet (F1.2)
RS485/2_P: Connector_Sheet (J31.2), RS485_RS232_Sheet (F2.2)
RS485_N: Connector_Sheet (J30.1), RS485_RS232_Sheet (F5.2)
RS485_P: Connector_Sheet (J30.2), RS485_RS232_Sheet (F6.2)
RXA_N: EtherCAT_Sheet (U10.54), RJ45_Sheet (C56.2 J9.6 R63.1)
RXA_P: EtherCAT_Sheet (U10.55), RJ45_Sheet (C57.2 J9.3 R64.1)
RXB_N: EtherCAT_Sheet (U10.61), RJ45_Sheet (C62.2 J10.6 R71.1)
RXB_P: EtherCAT_Sheet (U10.60), RJ45_Sheet (C63.2 J10.3 R72.1)
RXD/RS485_2: Controller_Sheet (U5.17), RS485_RS232_Sheet (R36.1 U7.4)
SPI2_MISO: Controller_Sheet (U5.53), EtherCAT_Sheet (U10.13)
SPI2_MOSI: Controller_Sheet (U5.54), EtherCAT_Sheet (U10.17)
SPI2_NSS: Controller_Sheet (U5.50), EtherCAT_Sheet (U10.50)
SPI2_SCK: Controller_Sheet (U5.51), EtherCAT_Sheet (U10.19)
SYNC0: Controller_Sheet (U5.14), EtherCAT_Sheet (U10.34)
SYNC1: Controller_Sheet (U5.13), EtherCAT_Sheet (U10.18)
TXA_N: EtherCAT_Sheet (U10.52), RJ45_Sheet (C58.2 J9.2 R65.1)
TXA_P: EtherCAT_Sheet (U10.53), RJ45_Sheet (C59.2 J9.1 R66.1)
TXB_N: EtherCAT_Sheet (U10.63), RJ45_Sheet (C64.2 J10.2 R73.1)
TXB_P: EtherCAT_Sheet (U10.62), RJ45_Sheet (C65.2 J10.1 R74.1)
TXD/RS485_2: Controller_Sheet (U5.18), RS485_RS232_Sheet (R33.1 U7.1)